# EAGLE schematic debug_backplane (EAGLE 6.6.0)
AUTHOR: Joshua Adkins and Pat Pannuto; REV: A; TITLE: Signpost Debug Backplane

## Sheet 1 of 15
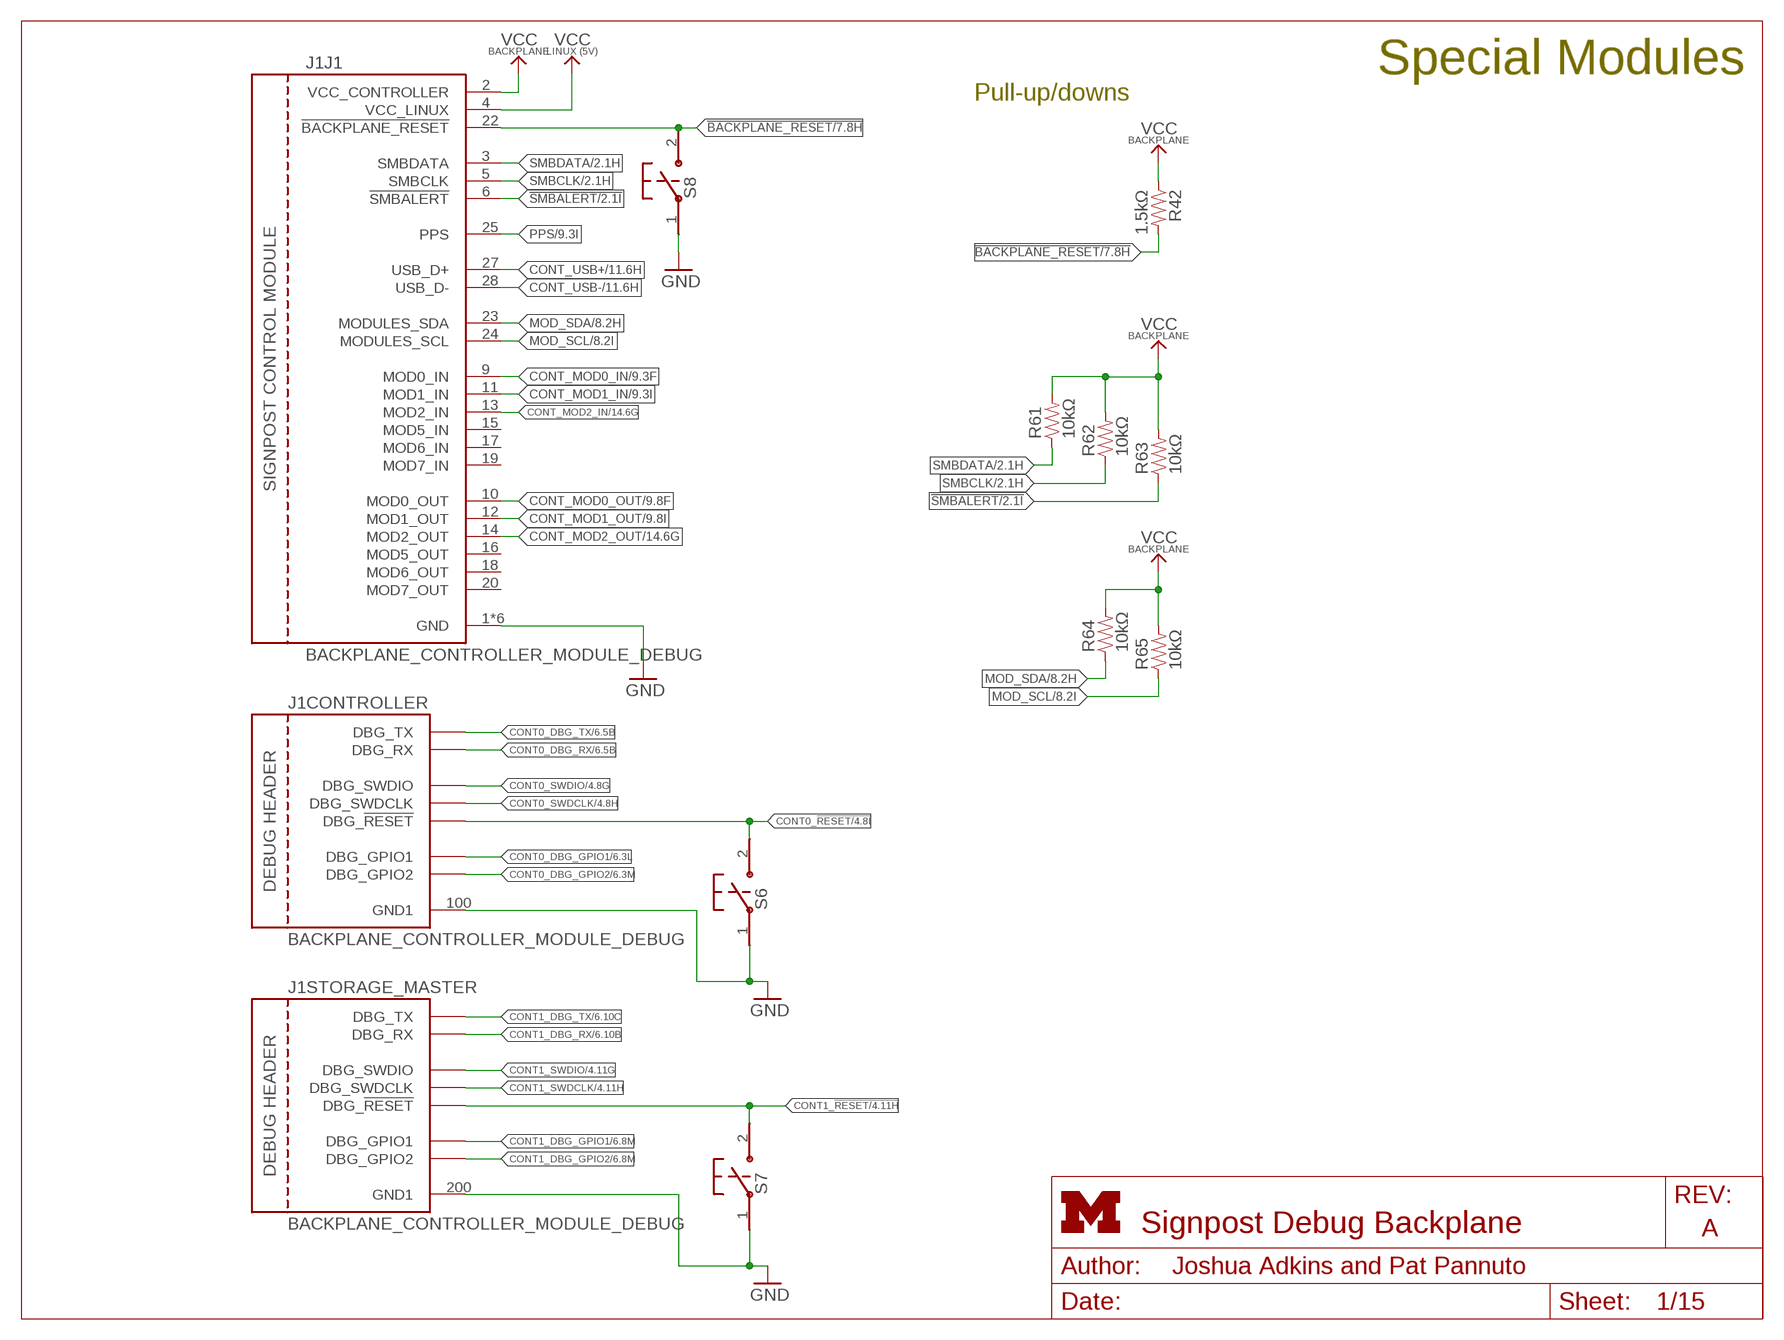
[diagram p0: schematic, sheet 1]
FRAME1 (LETTER_L): HEIGHT: 8.5in; WIDTH: 11in

### Parts
J1  BACKPLANE_CONTROLLER_MODULE_DEBUG  [BACKPLANE_MODULE_20PIN_10PIN_DEBUG]
R42  1.5kΩ  RESISTOR0603_RES  [0603-RES]
R61  10kΩ  RESISTOR0603_RES  [0603-RES]
R62  10kΩ  RESISTOR0603_RES  [0603-RES]
R63  10kΩ  RESISTOR0603_RES  [0603-RES]
R64  10kΩ  RESISTOR0603_RES  [0603-RES]
R65  10kΩ  RESISTOR0603_RES  [0603-RES]
S6  B3U-1000P  [B3U-1000P]
S7  B3U-1000P  [B3U-1000P]
S8  B3U-1000P  [B3U-1000P]

### Nets
!BACKPLANE_RESET: J1.22(J1:!BACKPLANE_RESET) R42.2 S8.2 ; also sheet 7,10,15
!SMBALERT: J1.6(J1:!SMBALERT) R63.1 ; also sheet 2,15
CONT0_!RESET: J1.105(CONTROLLER:DBG_!RESET) S6.2 ; also sheet 4
CONT0_DBG_GPIO1: J1.101(CONTROLLER:DBG_GPIO1) ; also sheet 6
CONT0_DBG_GPIO2: J1.104(CONTROLLER:DBG_GPIO2) ; also sheet 6
CONT0_DBG_RX: J1.103(CONTROLLER:DBG_RX) ; also sheet 6
CONT0_DBG_TX: J1.102(CONTROLLER:DBG_TX) ; also sheet 6
CONT0_SWDCLK: J1.106(CONTROLLER:DBG_SWDCLK) ; also sheet 4
CONT0_SWDIO: J1.107(CONTROLLER:DBG_SWDIO) ; also sheet 4
CONT1_!RESET: J1.205(STORAGE_MASTER:DBG_!RESET) S7.2 ; also sheet 4
CONT1_DBG_GPIO1: J1.201(STORAGE_MASTER:DBG_GPIO1) ; also sheet 6
CONT1_DBG_GPIO2: J1.204(STORAGE_MASTER:DBG_GPIO2) ; also sheet 6
CONT1_DBG_RX: J1.203(STORAGE_MASTER:DBG_RX) ; also sheet 6
CONT1_DBG_TX: J1.202(STORAGE_MASTER:DBG_TX) ; also sheet 6
CONT1_SWDCLK: J1.206(STORAGE_MASTER:DBG_SWDCLK) ; also sheet 4
CONT1_SWDIO: J1.207(STORAGE_MASTER:DBG_SWDIO) ; also sheet 4
CONT_MOD0_IN: J1.9(J1:MOD0_IN) ; also sheet 9
CONT_MOD0_OUT: J1.10(J1:MOD0_OUT) ; also sheet 9
CONT_MOD1_IN: J1.11(J1:MOD1_IN) ; also sheet 9
CONT_MOD1_OUT: J1.12(J1:MOD1_OUT) ; also sheet 9
CONT_MOD2_IN: J1.13(J1:MOD2_IN) ; also sheet 14
CONT_MOD2_OUT: J1.14(J1:MOD2_OUT) ; also sheet 14
CONT_USB+: J1.27(J1:USB_D+) ; also sheet 11
CONT_USB-: J1.28(J1:USB_D-) ; also sheet 11
GND: J1.1(J1:GND) J1.21(J1:GND) J1.100(CONTROLLER:GND1) J1.200(STORAGE_MASTER:GND1) J1.MNT1(J1:GND) J1.MNT2(J1:GND) J1.MNT3(J1:GND) J1.MNT4(J1:GND) S6.1 S7.1 S8.1 ; also sheet 2,3,4,5,6,7,8,9,10,11,12,13,14,15
MOD_SCL: J1.24(J1:MODULES_SCL) R65.1 ; also sheet 8,14,15
MOD_SDA: J1.23(J1:MODULES_SDA) R64.1 ; also sheet 8,14,15
PPS: J1.25(J1:PPS) ; also sheet 9,14,15
SMBCLK: J1.5(J1:SMBCLK) R62.1 ; also sheet 2,7,15
SMBDATA: J1.3(J1:SMBDATA) R61.1 ; also sheet 2,7,15
VCC_BACKPLANE: J1.2(J1:VCC_CONTROLLER) R42.1 R61.2 R62.2 R63.2 R64.2 R65.2 ; also sheet 2,7,8,9,10,11,12,13,15
VCC_LINUX: J1.4(J1:VCC_LINUX) ; also sheet 2,15
Unconnected: J1.15(J1:MOD5_IN) J1.16(J1:MOD5_OUT) J1.17(J1:MOD6_IN) J1.18(J1:MOD6_OUT) J1.19(J1:MOD7_IN) J1.20(J1:MOD7_OUT)

### Notes on the sheet
- Special Modules
- Pull-up/downs

## Sheet 2 of 15
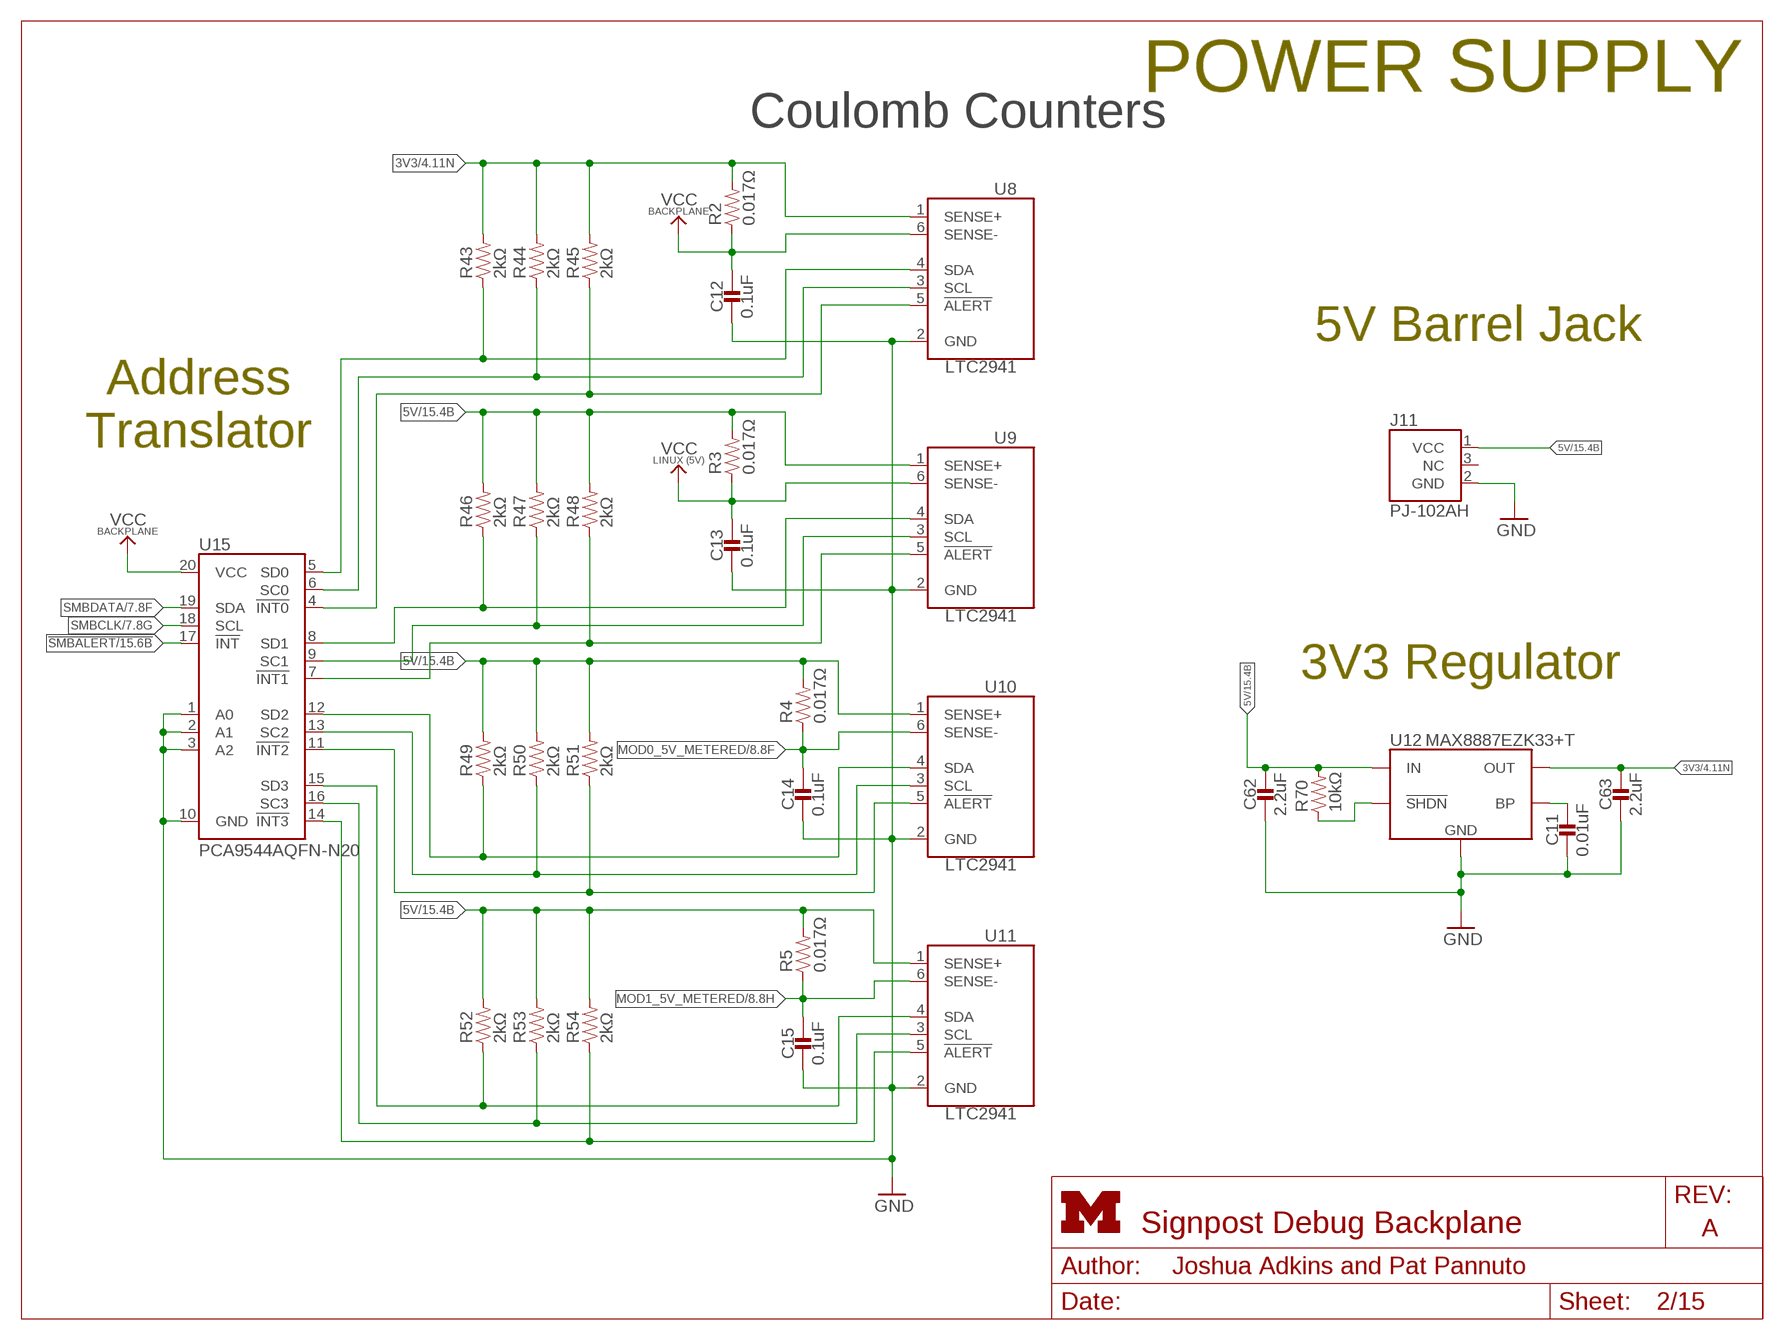
[diagram p1: schematic, sheet 2]
FRAME10 (LETTER_L_UMICH): HEIGHT: 8.5in; WIDTH: 11in

### Parts
C11  0.01uF  CAPACITOR0402_CAP  [0402_CAP]
C12  0.1uF  CAPACITOR0402_CAP  [0402_CAP]
C13  0.1uF  CAPACITOR0402_CAP  [0402_CAP]
C14  0.1uF  CAPACITOR0402_CAP  [0402_CAP]
C15  0.1uF  CAPACITOR0402_CAP  [0402_CAP]
C62  2.2uF  CAPACITOR0603_CAP  [0603_CAP]
C63  2.2uF  CAPACITOR0603_CAP  [0603_CAP]
J11  PJ-102AH  [PJ-102AH]
R2  0.017Ω  RESISTOR0805_RES  [0805_RES]
R3  0.017Ω  RESISTOR0805_RES  [0805_RES]
R4  0.017Ω  RESISTOR0805_RES  [0805_RES]
R5  0.017Ω  RESISTOR0805_RES  [0805_RES]
R43  2kΩ  RESISTOR0402_RES  [0402_RES]
R44  2kΩ  RESISTOR0402_RES  [0402_RES]
R45  2kΩ  RESISTOR0402_RES  [0402_RES]
R46  2kΩ  RESISTOR0402_RES  [0402_RES]
R47  2kΩ  RESISTOR0402_RES  [0402_RES]
R48  2kΩ  RESISTOR0402_RES  [0402_RES]
R49  2kΩ  RESISTOR0402_RES  [0402_RES]
R50  2kΩ  RESISTOR0402_RES  [0402_RES]
R51  2kΩ  RESISTOR0402_RES  [0402_RES]
R52  2kΩ  RESISTOR0402_RES  [0402_RES]
R53  2kΩ  RESISTOR0402_RES  [0402_RES]
R54  2kΩ  RESISTOR0402_RES  [0402_RES]
R70  10kΩ  RESISTOR0603_RES  [0603-RES]
U8  LTC2941  [DFN-6-2MMX3MM]
U9  LTC2941  [DFN-6-2MMX3MM]
U10  LTC2941  [DFN-6-2MMX3MM]
U11  LTC2941  [DFN-6-2MMX3MM]
U12  MAX8887EZK33+T  [SOT-23-5]
U15  PCA9544AQFN-N20  [QFN-N20]

### Nets
3V3: C63.1 R2.2 R43.2 R44.2 R45.2 U8.1(SENSE+) U12.5(OUT) ; also sheet 4,5,6,14,15
5V: C62.1 J11.1(VCC) R3.2 R4.2 R5.2 R46.2 R47.2 R48.2 R49.2 R50.2 R51.2 R52.2 R53.2 R54.2 R70.2 U9.1(SENSE+) U10.1(SENSE+) U11.1(SENSE+) U12.1(IN) ; also sheet 15
!SMBALERT: U15.17(!INT) ; also sheet 1,15
GND: C11.2 C12.2 C13.2 C14.2 C15.2 C62.2 C63.2 J11.2(GND) U8.2(GND) U9.2(GND) U10.2(GND) U11.2(GND) U12.2(GND) U15.1(A0) U15.2(A1) U15.3(A2) U15.10(GND) ; also sheet 1,3,4,5,6,7,8,9,10,11,12,13,14,15
MOD0_5V_METERED: C14.1 R4.1 U10.6(SENSE-) ; also sheet 8,13,15
MOD1_5V_METERED: C15.1 R5.1 U11.6(SENSE-) ; also sheet 8,13,15
N$4: R70.1 U12.3(!SHDN)
N$7: C11.1 U12.4(BP)
N$43: R43.1 U8.4(SDA) U15.5(SD0)
N$47: R44.1 U8.3(SCL) U15.6(SC0)
N$52: R49.1 U10.4(SDA) U15.12(SD2)
N$53: R50.1 U10.3(SCL) U15.13(SC2)
N$54: R51.1 U10.5(!ALERT) U15.11(!INT2)
N$55: R52.1 U11.4(SDA) U15.15(SD3)
N$56: R53.1 U11.3(SCL) U15.16(SC3)
N$57: R54.1 U11.5(!ALERT) U15.14(!INT3)
N$67: R45.1 U8.5(!ALERT) U15.4(!INT0)
N$68: R46.1 U9.4(SDA) U15.8(SD1)
N$70: R47.1 U9.3(SCL) U15.9(SC1)
N$71: R48.1 U9.5(!ALERT) U15.7(!INT1)
SMBCLK: U15.18(SCL) ; also sheet 1,7,15
SMBDATA: U15.19(SDA) ; also sheet 1,7,15
VCC_BACKPLANE: C12.1 R2.1 U8.6(SENSE-) U15.20(VCC) ; also sheet 1,7,8,9,10,11,12,13,15
VCC_LINUX: C13.1 R3.1 U9.6(SENSE-) ; also sheet 1,15
Unconnected: J11.3(NC)

### Notes on the sheet
- POWER SUPPLY
- Coulomb Counters
- 5V Barrel Jack
- Address
  Translator
- 3V3 Regulator

## Sheet 3 of 15
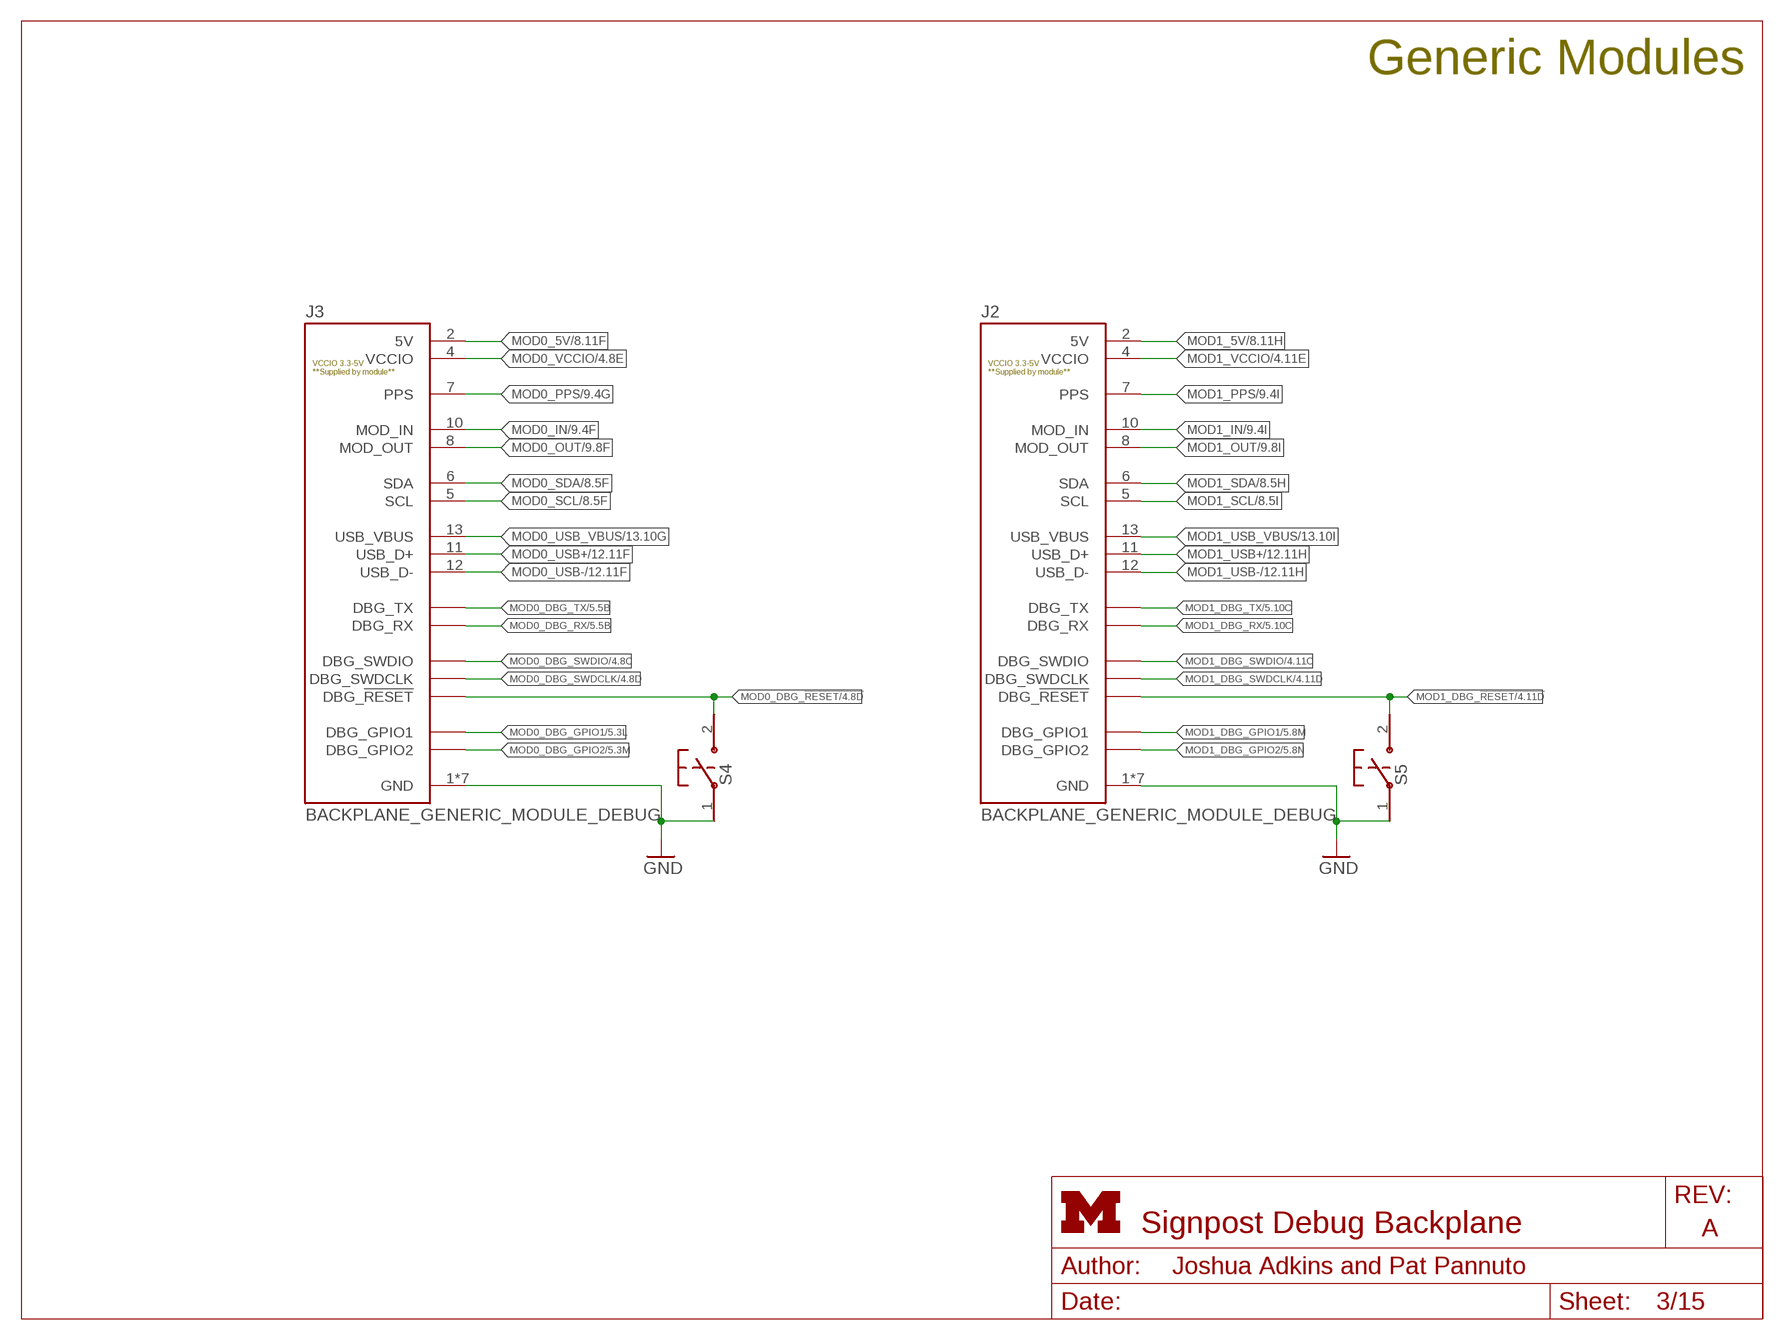
[diagram p2: schematic, sheet 3]
FRAME2 (LETTER_L): HEIGHT: 8.5in; WIDTH: 11in

### Parts
J2  BACKPLANE_GENERIC_MODULE_DEBUG  [BACKPLANE_MODULE_14PIN_8PIN]
J3  BACKPLANE_GENERIC_MODULE_DEBUG  [BACKPLANE_MODULE_14PIN_8PIN]
S4  B3U-1000P  [B3U-1000P]
S5  B3U-1000P  [B3U-1000P]

### Nets
GND: J2.1(GND) J2.14(GND) J2.15(GND) J2.MNT1(GND) J2.MNT2(GND) J2.MNT3(GND) J2.MNT4(GND) J3.1(GND) J3.14(GND) J3.15(GND) J3.MNT1(GND) J3.MNT2(GND) J3.MNT3(GND) J3.MNT4(GND) S4.1 S5.1 ; also sheet 1,2,4,5,6,7,8,9,10,11,12,13,14,15
MOD0_5V: J3.2(5V) ; also sheet 8,15
MOD0_DBG_!RESET: J3.20(DBG_!RESET) S4.2 ; also sheet 4
MOD0_DBG_GPIO1: J3.16(DBG_GPIO1) ; also sheet 5
MOD0_DBG_GPIO2: J3.19(DBG_GPIO2) ; also sheet 5
MOD0_DBG_RX: J3.18(DBG_RX) ; also sheet 5
MOD0_DBG_SWDCLK: J3.21(DBG_SWDCLK) ; also sheet 4
MOD0_DBG_SWDIO: J3.22(DBG_SWDIO) ; also sheet 4
MOD0_DBG_TX: J3.17(DBG_TX) ; also sheet 5
MOD0_IN: J3.10(MOD_IN) ; also sheet 9,15
MOD0_OUT: J3.8(MOD_OUT) ; also sheet 9,15
MOD0_PPS: J3.7(PPS) ; also sheet 9,15
MOD0_SCL: J3.5(SCL) ; also sheet 8,15
MOD0_SDA: J3.6(SDA) ; also sheet 8,15
MOD0_USB+: J3.11(USB_D+) ; also sheet 12
MOD0_USB-: J3.12(USB_D-) ; also sheet 12
MOD0_USB_VBUS: J3.13(USB_VBUS) ; also sheet 13,15
MOD0_VCCIO: J3.4(VCCIO) ; also sheet 4,5,8,9,15
MOD1_5V: J2.2(5V) ; also sheet 8,15
MOD1_DBG_!RESET: J2.20(DBG_!RESET) S5.2 ; also sheet 4
MOD1_DBG_GPIO1: J2.16(DBG_GPIO1) ; also sheet 5
MOD1_DBG_GPIO2: J2.19(DBG_GPIO2) ; also sheet 5
MOD1_DBG_RX: J2.18(DBG_RX) ; also sheet 5
MOD1_DBG_SWDCLK: J2.21(DBG_SWDCLK) ; also sheet 4
MOD1_DBG_SWDIO: J2.22(DBG_SWDIO) ; also sheet 4
MOD1_DBG_TX: J2.17(DBG_TX) ; also sheet 5
MOD1_IN: J2.10(MOD_IN) ; also sheet 9,15
MOD1_OUT: J2.8(MOD_OUT) ; also sheet 9,15
MOD1_PPS: J2.7(PPS) ; also sheet 9,15
MOD1_SCL: J2.5(SCL) ; also sheet 8,15
MOD1_SDA: J2.6(SDA) ; also sheet 8,15
MOD1_USB+: J2.11(USB_D+) ; also sheet 12
MOD1_USB-: J2.12(USB_D-) ; also sheet 12
MOD1_USB_VBUS: J2.13(USB_VBUS) ; also sheet 13,15
MOD1_VCCIO: J2.4(VCCIO) ; also sheet 4,5,8,9,15

### Notes on the sheet
- Generic Modules

## Sheet 4 of 15
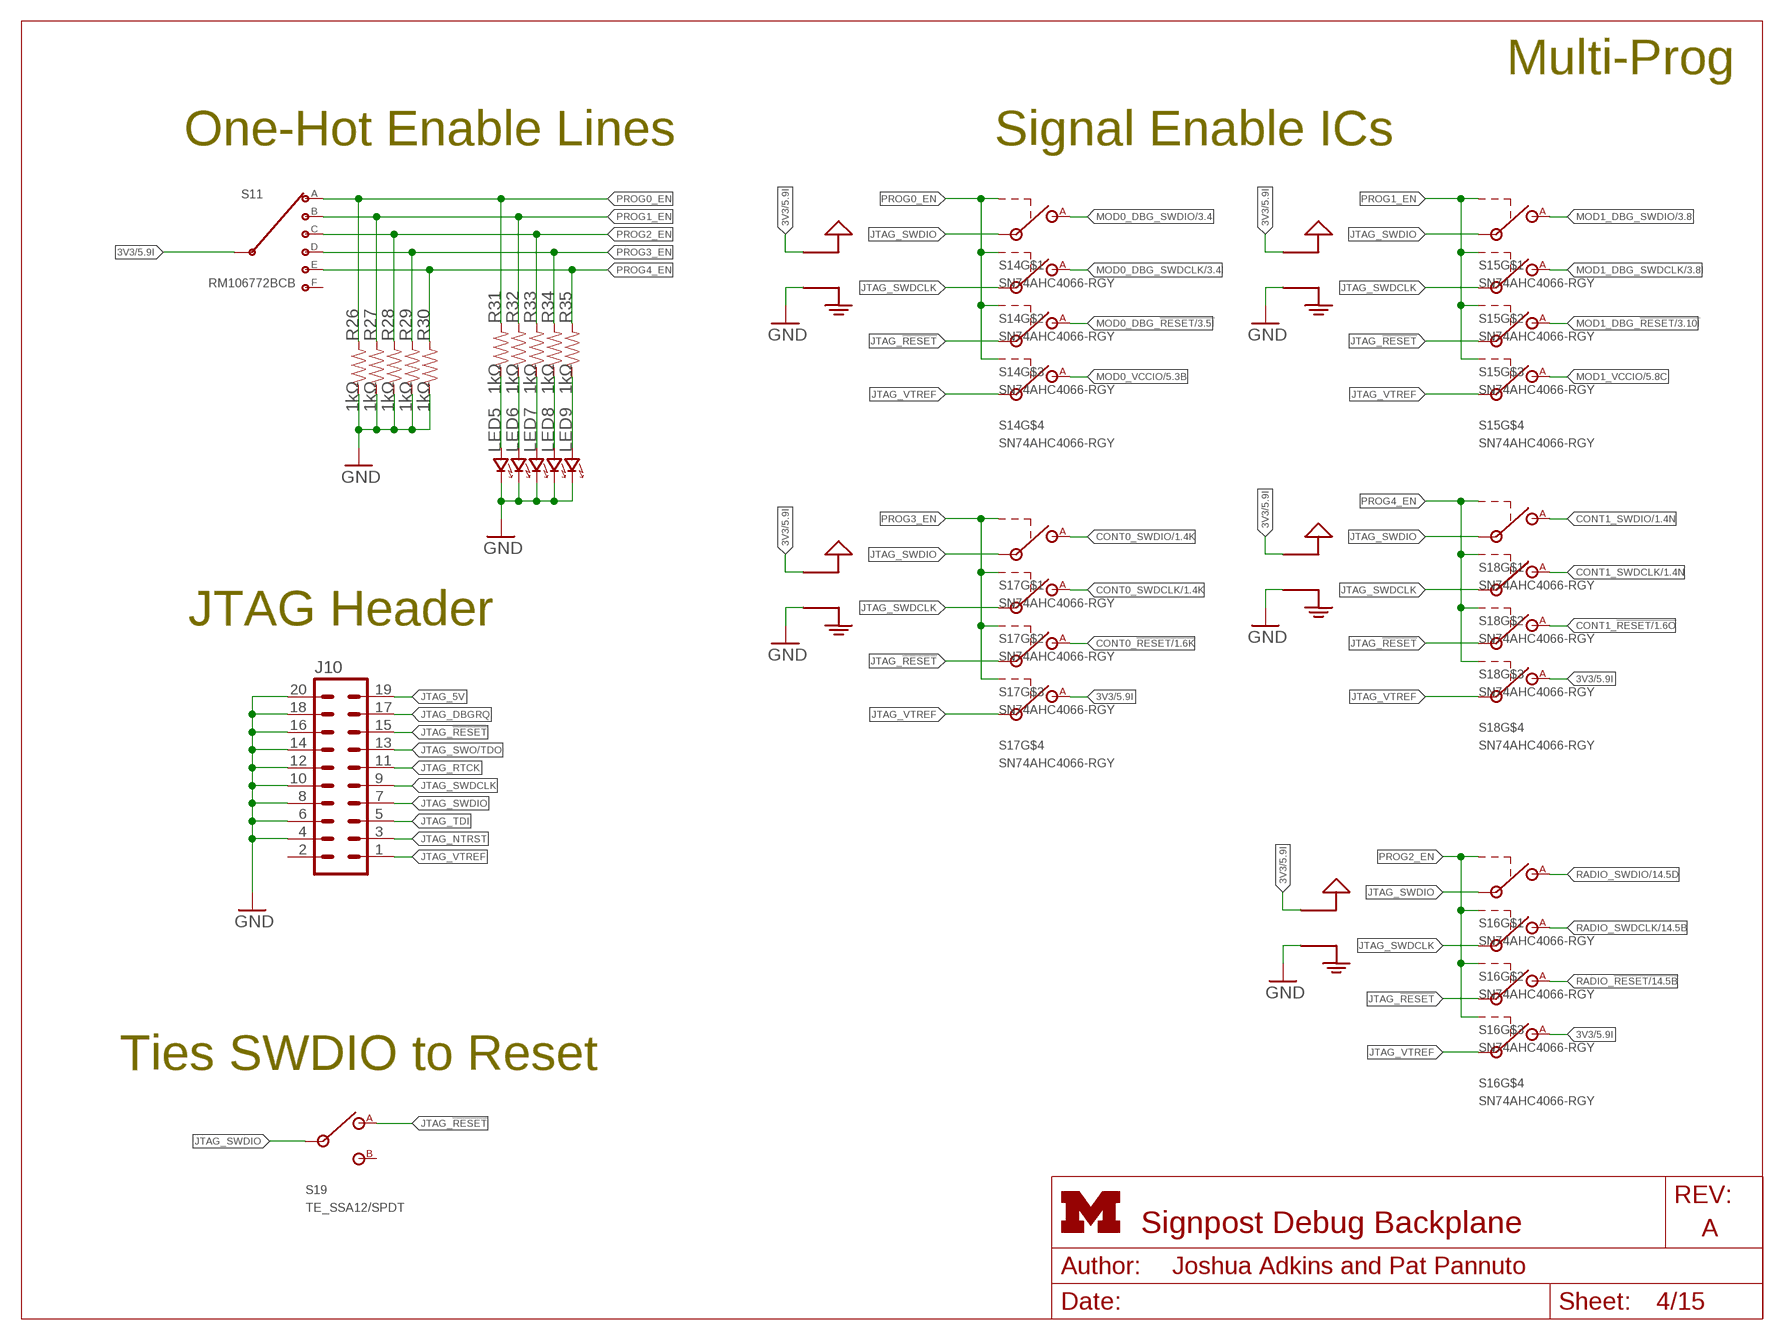
[diagram p3: schematic, sheet 4]
FRAME15 (LETTER_L_UMICH): HEIGHT: 8.5in; WIDTH: 11in

### Parts
J10  ML20  [ML20]
LED5  LED0603  [LED-0603]
LED6  LED0603  [LED-0603]
LED7  LED0603  [LED-0603]
LED8  LED0603  [LED-0603]
LED9  LED0603  [LED-0603]
R26  1kΩ  RESISTOR0603_RES  [0603-RES]
R27  1kΩ  RESISTOR0603_RES  [0603-RES]
R28  1kΩ  RESISTOR0603_RES  [0603-RES]
R29  1kΩ  RESISTOR0603_RES  [0603-RES]
R30  1kΩ  RESISTOR0603_RES  [0603-RES]
R31  1kΩ  RESISTOR0603_RES  [0603-RES]
R32  1kΩ  RESISTOR0603_RES  [0603-RES]
R33  1kΩ  RESISTOR0603_RES  [0603-RES]
R34  1kΩ  RESISTOR0603_RES  [0603-RES]
R35  1kΩ  RESISTOR0603_RES  [0603-RES]
S11  RM106772BCB  [RM-SWITCH]
S14  SN74AHC4066-RGY  [S-PVQFN-N14-3.5MM]
S15  SN74AHC4066-RGY  [S-PVQFN-N14-3.5MM]
S16  SN74AHC4066-RGY  [S-PVQFN-N14-3.5MM]
S17  SN74AHC4066-RGY  [S-PVQFN-N14-3.5MM]
S18  SN74AHC4066-RGY  [S-PVQFN-N14-3.5MM]
S19  TE_SSA12/SPDT  [TE_SSA12/SPDT]

### Nets
3V3: S11.C(INPUT) S14.14(VCC) S15.14(VCC) S16.10(A) S16.14(VCC) S17.10(A) S17.14(VCC) S18.10(A) S18.14(VCC) ; also sheet 2,5,6,14,15
CONT0_!RESET: S17.9(A) ; also sheet 1
CONT0_SWDCLK: S17.3(A) ; also sheet 1
CONT0_SWDIO: S17.2(A) ; also sheet 1
CONT1_!RESET: S18.9(A) ; also sheet 1
CONT1_SWDCLK: S18.3(A) ; also sheet 1
CONT1_SWDIO: S18.2(A) ; also sheet 1
GND: J10.4 J10.6 J10.8 J10.10 J10.12 J10.14 J10.16 J10.18 J10.20 LED5.C(CATHODE) LED6.C(CATHODE) LED7.C(CATHODE) LED8.C(CATHODE) LED9.C(CATHODE) R26.1 R27.1 R28.1 R29.1 R30.1 S14.7(GND) S15.7(GND) S16.7(GND) S17.7(GND) S18.7(GND) ; also sheet 1,2,3,5,6,7,8,9,10,11,12,13,14,15
JTAG_5V: J10.19
JTAG_!RESET: J10.15 S14.8(IN) S15.8(IN) S16.8(IN) S17.8(IN) S18.8(IN) S19.1(A)
JTAG_DBGRQ: J10.17
JTAG_NTRST: J10.3
JTAG_RTCK: J10.11
JTAG_SWDCLK: J10.9 S14.4(IN) S15.4(IN) S16.4(IN) S17.4(IN) S18.4(IN)
JTAG_SWDIO: J10.7 S14.1(IN) S15.1(IN) S16.1(IN) S17.1(IN) S18.1(IN) S19.IN
JTAG_SWO/TDO: J10.13
JTAG_TDI: J10.5
JTAG_VTREF: J10.1 S14.11(IN) S15.11(IN) S16.11(IN) S17.11(IN) S18.11(IN)
MOD0_DBG_!RESET: S14.9(A) ; also sheet 3
MOD0_DBG_SWDCLK: S14.3(A) ; also sheet 3
MOD0_DBG_SWDIO: S14.2(A) ; also sheet 3
MOD0_VCCIO: S14.10(A) ; also sheet 3,5,8,9,15
MOD1_DBG_!RESET: S15.9(A) ; also sheet 3
MOD1_DBG_SWDCLK: S15.3(A) ; also sheet 3
MOD1_DBG_SWDIO: S15.2(A) ; also sheet 3
MOD1_VCCIO: S15.10(A) ; also sheet 3,5,8,9,15
N$28: LED6.A(ANODE) R32.1
N$58: LED5.A(ANODE) R31.1
N$59: LED7.A(ANODE) R33.1
N$60: LED8.A(ANODE) R34.1
N$61: LED9.A(ANODE) R35.1
PROG0_EN: R26.2 R31.2 S11.1(A) S14.5(CTRL) S14.6(CTRL) S14.12(CTRL) S14.13(CTRL)
PROG1_EN: R27.2 R32.2 S11.2(B) S15.5(CTRL) S15.6(CTRL) S15.12(CTRL) S15.13(CTRL)
PROG2_EN: R28.2 R33.2 S11.3(C) S16.5(CTRL) S16.6(CTRL) S16.12(CTRL) S16.13(CTRL)
PROG3_EN: R29.2 R34.2 S11.4(D) S17.5(CTRL) S17.6(CTRL) S17.12(CTRL) S17.13(CTRL)
PROG4_EN: R30.2 R35.2 S11.5(E) S18.5(CTRL) S18.6(CTRL) S18.12(CTRL) S18.13(CTRL)
RADIO_!RESET: S16.9(A) ; also sheet 14
RADIO_SWDCLK: S16.3(A) ; also sheet 14
RADIO_SWDIO: S16.2(A) ; also sheet 14
Unconnected: J10.2 S11.6(F) S19.2(B)

### Notes on the sheet
- Multi-Prog
- One-Hot Enable Lines | Signal Enable ICs
- JTAG Header
- Ties SWDIO to Reset

## Sheet 5 of 15
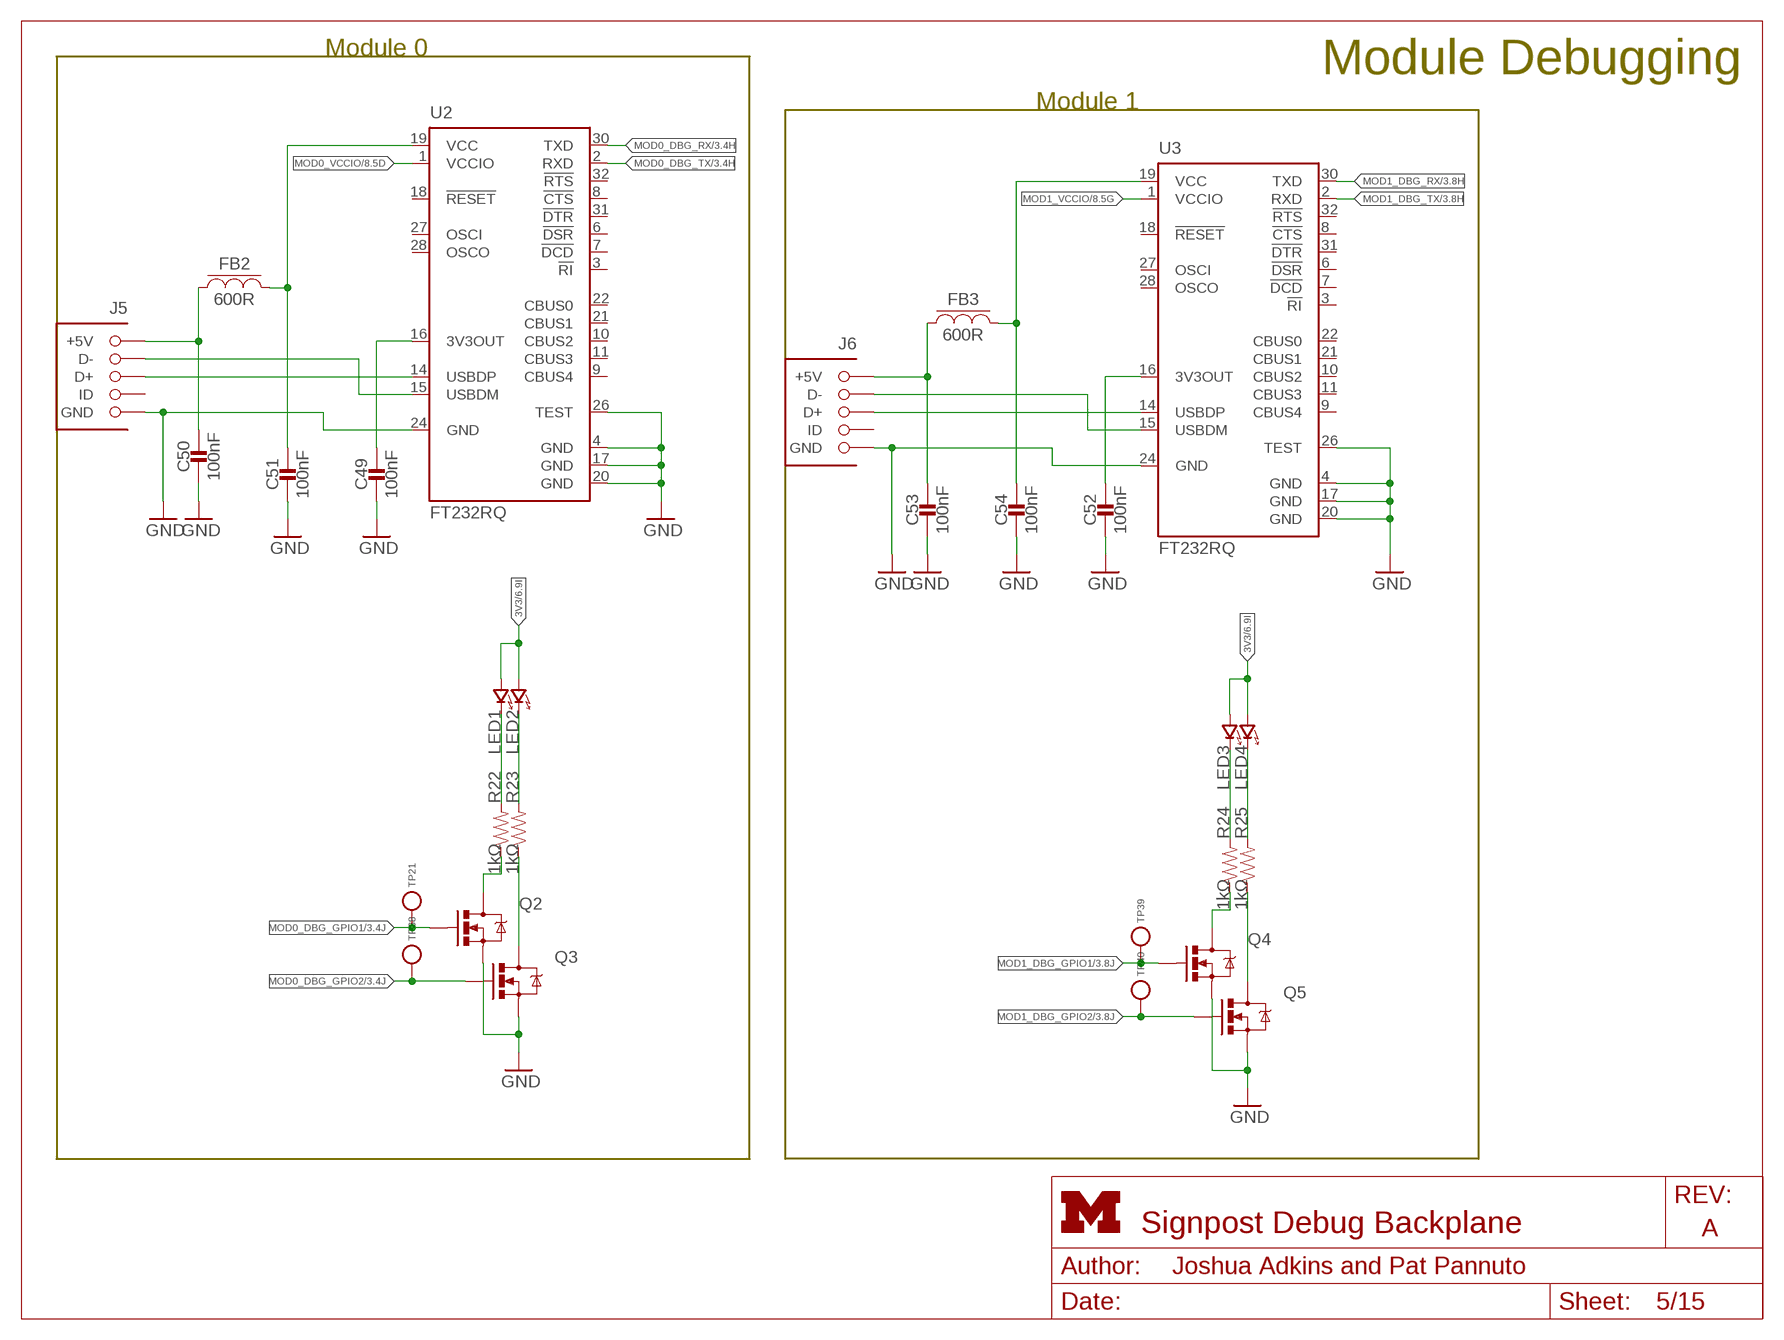
[diagram p4: schematic, sheet 5]
FRAME12 (LETTER_L_UMICH): HEIGHT: 8.5in; WIDTH: 11in

### Parts
C49  100nF  CAPACITOR0603_CAP  [0603_CAP]
C50  100nF  CAPACITOR0603_CAP  [0603_CAP]
C51  100nF  CAPACITOR0603_CAP  [0603_CAP]
C52  100nF  CAPACITOR0603_CAP  [0603_CAP]
C53  100nF  CAPACITOR0603_CAP  [0603_CAP]
C54  100nF  CAPACITOR0603_CAP  [0603_CAP]
FB2  600R  FERRITE_BEAD0603  [0603_CAP]
FB3  600R  FERRITE_BEAD0603  [0603_CAP]
J5  MICRO_USB_B_HIROSE_ZX62R-B-5P  [USB_MICRO_B-HIROSE-ZX62R-B-5P]
J6  MICRO_USB_B_HIROSE_ZX62R-B-5P  [USB_MICRO_B-HIROSE-ZX62R-B-5P]
LED1  LED0603  [LED-0603]
LED2  LED0603  [LED-0603]
LED3  LED0603  [LED-0603]
LED4  LED0603  [LED-0603]
Q2  MOSFET-NCHANNELSMD  [SOT23-3]
Q3  MOSFET-NCHANNELSMD  [SOT23-3]
Q4  MOSFET-NCHANNELSMD  [SOT23-3]
Q5  MOSFET-NCHANNELSMD  [SOT23-3]
R22  1kΩ  RESISTOR0603_RES  [0603-RES]
R23  1kΩ  RESISTOR0603_RES  [0603-RES]
R24  1kΩ  RESISTOR0603_RES  [0603-RES]
R25  1kΩ  RESISTOR0603_RES  [0603-RES]
TP21  TEST_POINT_0.040IN  [TESTPOINT_0.040IN]
TP38  TEST_POINT_0.040IN  [TESTPOINT_0.040IN]
TP39  TEST_POINT_0.040IN  [TESTPOINT_0.040IN]
TP40  TEST_POINT_0.040IN  [TESTPOINT_0.040IN]
U2  FT232RQ  [QFN32]
U3  FT232RQ  [QFN32]

### Nets
3V3: LED1.A(ANODE) LED2.A(ANODE) LED3.A(ANODE) LED4.A(ANODE) ; also sheet 2,4,6,14,15
GND: C49.2 C50.2 C51.2 C52.2 C53.2 C54.2 J5.5(GND) J6.5(GND) Q2.2(S) Q3.2(S) Q4.2(S) Q5.2(S) U2.4(GND) U2.17(GND) U2.20(GND) U2.24(GND) U2.26(TEST) U3.4(GND) U3.17(GND) U3.20(GND) U3.24(GND) U3.26(TEST) ; also sheet 1,2,3,4,6,7,8,9,10,11,12,13,14,15
MOD0_DBG_GPIO1: Q2.1(G) TP21.TESTPOINT ; also sheet 3
MOD0_DBG_GPIO2: Q3.1(G) TP38.TESTPOINT ; also sheet 3
MOD0_DBG_RX: U2.30(TXD) ; also sheet 3
MOD0_DBG_TX: U2.2(RXD) ; also sheet 3
MOD0_VCCIO: U2.1(VCCIO) ; also sheet 3,4,8,9,15
MOD1_DBG_GPIO1: Q4.1(G) TP39.TESTPOINT ; also sheet 3
MOD1_DBG_GPIO2: Q5.1(G) TP40.TESTPOINT ; also sheet 3
MOD1_DBG_RX: U3.30(TXD) ; also sheet 3
MOD1_DBG_TX: U3.2(RXD) ; also sheet 3
MOD1_VCCIO: U3.1(VCCIO) ; also sheet 3,4,8,9,15
N$5: LED1.C(CATHODE) R22.2
N$6: LED2.C(CATHODE) R23.2
N$8: Q2.3(D) R22.1
N$9: Q3.3(D) R23.1
N$15: LED3.C(CATHODE) R24.2
N$16: LED4.C(CATHODE) R25.2
N$18: Q4.3(D) R24.1
N$19: Q5.3(D) R25.1
N$24: J5.2(D-) U2.15(USBDM)
N$29: J5.3(D+) U2.14(USBDP)
N$30: C50.1 FB2.1 J5.1(+5V)
N$32: C51.1 FB2.2 U2.19(VCC)
N$34: C49.1 U2.16(3V3OUT)
N$35: J6.2(D-) U3.15(USBDM)
N$36: J6.3(D+) U3.14(USBDP)
N$37: C53.1 FB3.1 J6.1(+5V)
N$50: C54.1 FB3.2 U3.19(VCC)
N$51: C52.1 U3.16(3V3OUT)
Unconnected: J5.4(ID) J6.4(ID) U2.3(!RI) U2.6(!DSR) U2.7(!DCD) U2.8(!CTS) U2.9(CBUS4) U2.10(CBUS2) U2.11(CBUS3) U2.18(!RESET) U2.21(CBUS1) U2.22(CBUS0) U2.27(OSCI) U2.28(OSCO) U2.31(!DTR) U2.32(!RTS) U3.3(!RI) U3.6(!DSR) U3.7(!DCD) U3.8(!CTS) U3.9(CBUS4) U3.10(CBUS2) U3.11(CBUS3) U3.18(!RESET) U3.21(CBUS1) U3.22(CBUS0) U3.27(OSCI) U3.28(OSCO) U3.31(!DTR) U3.32(!RTS)

### Notes on the sheet
- Module 0
- Module Debugging
- Module 1

## Sheet 6 of 15
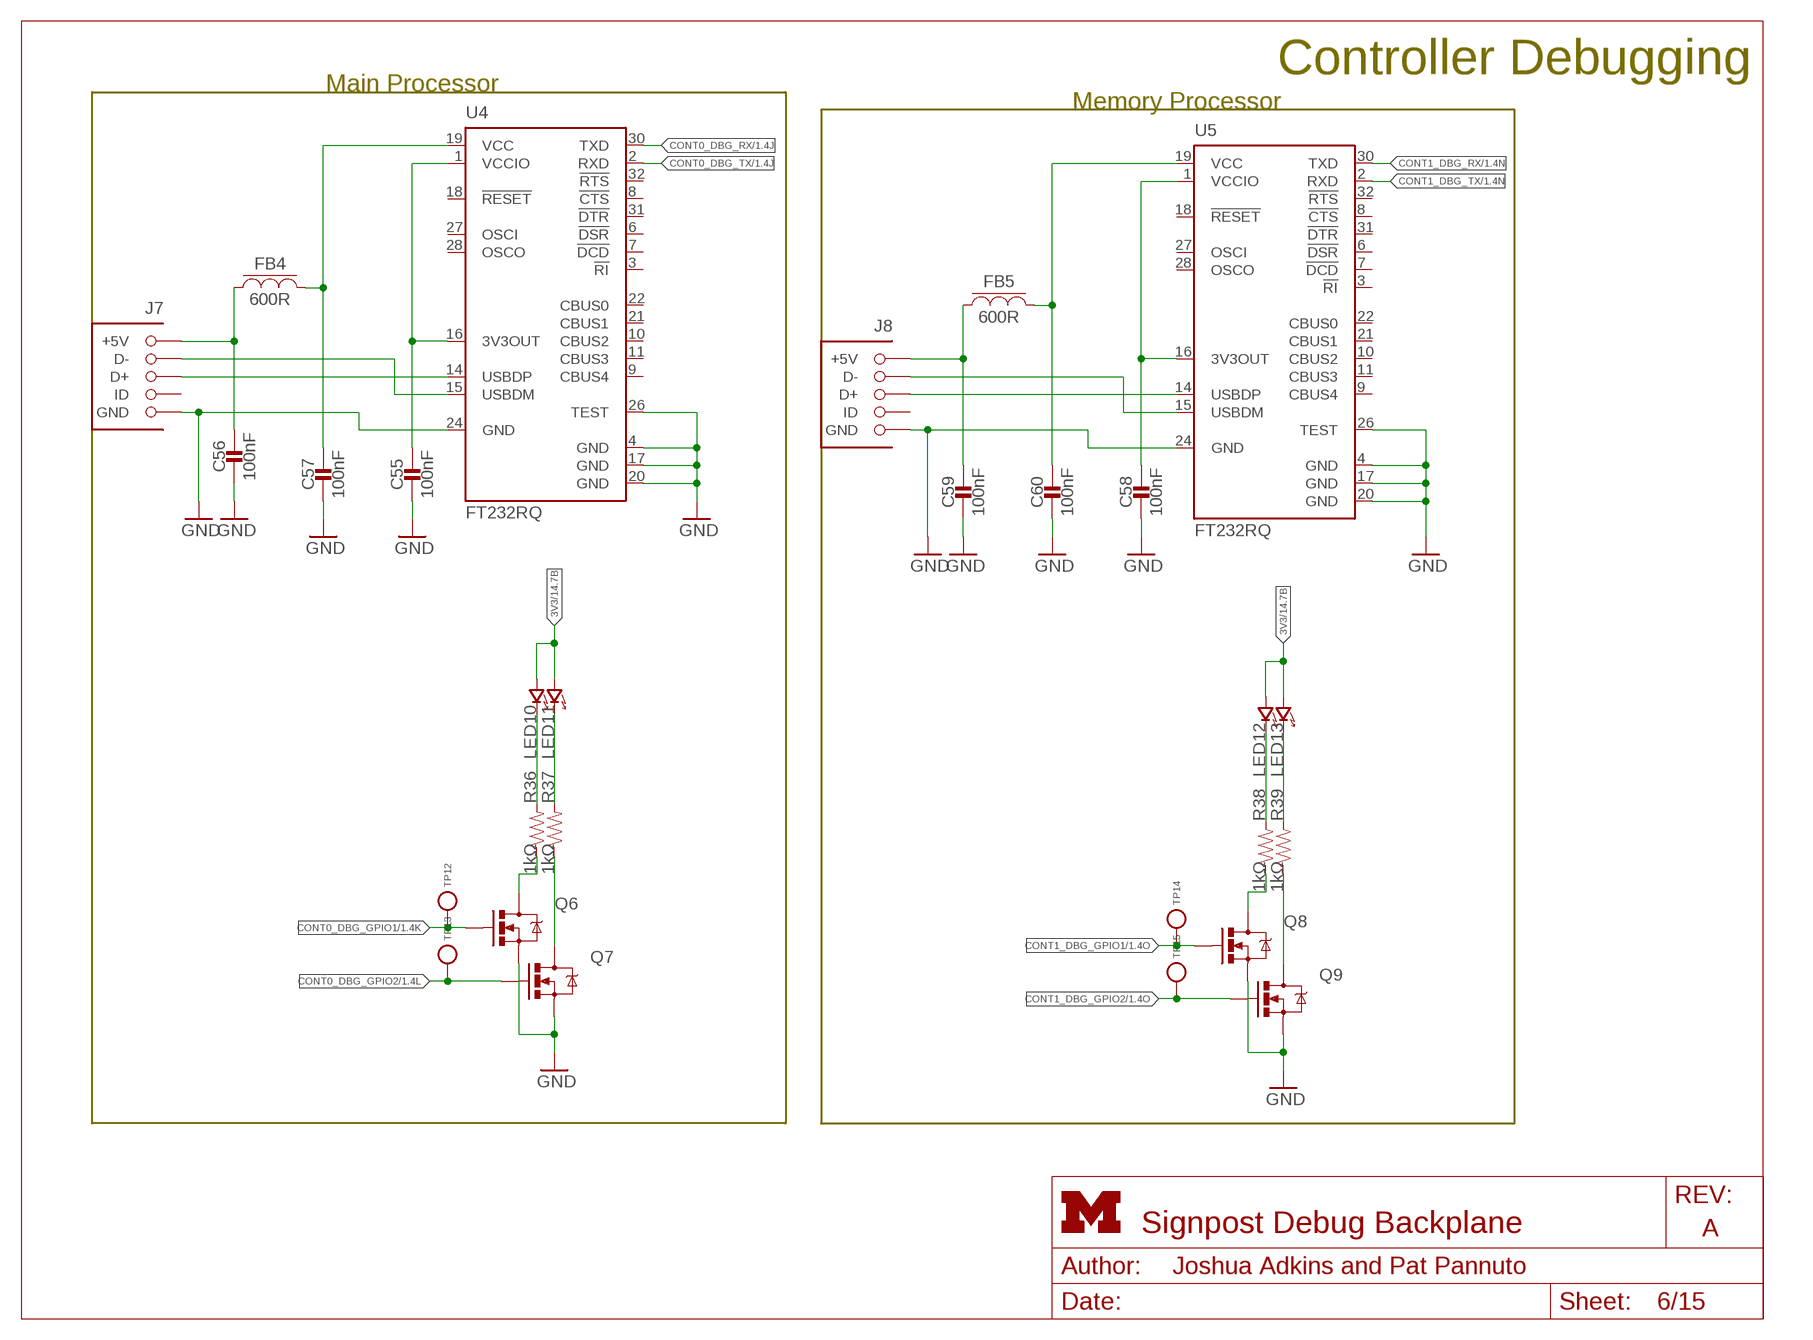
[diagram p5: schematic, sheet 6]
FRAME13 (LETTER_L_UMICH): HEIGHT: 8.5in; WIDTH: 11in

### Parts
C55  100nF  CAPACITOR0603_CAP  [0603_CAP]
C56  100nF  CAPACITOR0603_CAP  [0603_CAP]
C57  100nF  CAPACITOR0603_CAP  [0603_CAP]
C58  100nF  CAPACITOR0603_CAP  [0603_CAP]
C59  100nF  CAPACITOR0603_CAP  [0603_CAP]
C60  100nF  CAPACITOR0603_CAP  [0603_CAP]
FB4  600R  FERRITE_BEAD0603  [0603_CAP]
FB5  600R  FERRITE_BEAD0603  [0603_CAP]
J7  MICRO_USB_B_HIROSE_ZX62R-B-5P  [USB_MICRO_B-HIROSE-ZX62R-B-5P]
J8  MICRO_USB_B_HIROSE_ZX62R-B-5P  [USB_MICRO_B-HIROSE-ZX62R-B-5P]
LED10  LED0603  [LED-0603]
LED11  LED0603  [LED-0603]
LED12  LED0603  [LED-0603]
LED13  LED0603  [LED-0603]
Q6  MOSFET-NCHANNELSMD  [SOT23-3]
Q7  MOSFET-NCHANNELSMD  [SOT23-3]
Q8  MOSFET-NCHANNELSMD  [SOT23-3]
Q9  MOSFET-NCHANNELSMD  [SOT23-3]
R36  1kΩ  RESISTOR0603_RES  [0603-RES]
R37  1kΩ  RESISTOR0603_RES  [0603-RES]
R38  1kΩ  RESISTOR0603_RES  [0603-RES]
R39  1kΩ  RESISTOR0603_RES  [0603-RES]
TP12  TEST_POINT_0.040IN  [TESTPOINT_0.040IN]
TP13  TEST_POINT_0.040IN  [TESTPOINT_0.040IN]
TP14  TEST_POINT_0.040IN  [TESTPOINT_0.040IN]
TP15  TEST_POINT_0.040IN  [TESTPOINT_0.040IN]
U4  FT232RQ  [QFN32]
U5  FT232RQ  [QFN32]

### Nets
3V3: LED10.A(ANODE) LED11.A(ANODE) LED12.A(ANODE) LED13.A(ANODE) ; also sheet 2,4,5,14,15
CONT0_DBG_GPIO1: Q6.1(G) TP12.TESTPOINT ; also sheet 1
CONT0_DBG_GPIO2: Q7.1(G) TP13.TESTPOINT ; also sheet 1
CONT0_DBG_RX: U4.30(TXD) ; also sheet 1
CONT0_DBG_TX: U4.2(RXD) ; also sheet 1
CONT0_VCCIO: C55.1 U4.1(VCCIO) U4.16(3V3OUT)
CONT1_DBG_GPIO1: Q8.1(G) TP14.TESTPOINT ; also sheet 1
CONT1_DBG_GPIO2: Q9.1(G) TP15.TESTPOINT ; also sheet 1
CONT1_DBG_RX: U5.30(TXD) ; also sheet 1
CONT1_DBG_TX: U5.2(RXD) ; also sheet 1
CONT1_VCCIO: C58.1 U5.1(VCCIO) U5.16(3V3OUT)
GND: C55.2 C56.2 C57.2 C58.2 C59.2 C60.2 J7.5(GND) J8.5(GND) Q6.2(S) Q7.2(S) Q8.2(S) Q9.2(S) U4.4(GND) U4.17(GND) U4.20(GND) U4.24(GND) U4.26(TEST) U5.4(GND) U5.17(GND) U5.20(GND) U5.24(GND) U5.26(TEST) ; also sheet 1,2,3,4,5,7,8,9,10,11,12,13,14,15
N$20: J7.2(D-) U4.15(USBDM)
N$21: J7.3(D+) U4.14(USBDP)
N$22: C56.1 FB4.1 J7.1(+5V)
N$23: C57.1 FB4.2 U4.19(VCC)
N$62: J8.2(D-) U5.15(USBDM)
N$63: J8.3(D+) U5.14(USBDP)
N$64: C59.1 FB5.1 J8.1(+5V)
N$65: C60.1 FB5.2 U5.19(VCC)
N$69: LED10.C(CATHODE) R36.2
N$72: LED11.C(CATHODE) R37.2
N$75: Q6.3(D) R36.1
N$76: Q7.3(D) R37.1
N$77: LED12.C(CATHODE) R38.2
N$78: LED13.C(CATHODE) R39.2
N$79: Q8.3(D) R38.1
N$80: Q9.3(D) R39.1
Unconnected: J7.4(ID) J8.4(ID) U4.3(!RI) U4.6(!DSR) U4.7(!DCD) U4.8(!CTS) U4.9(CBUS4) U4.10(CBUS2) U4.11(CBUS3) U4.18(!RESET) U4.21(CBUS1) U4.22(CBUS0) U4.27(OSCI) U4.28(OSCO) U4.31(!DTR) U4.32(!RTS) U5.3(!RI) U5.6(!DSR) U5.7(!DCD) U5.8(!CTS) U5.9(CBUS4) U5.10(CBUS2) U5.11(CBUS3) U5.18(!RESET) U5.21(CBUS1) U5.22(CBUS0) U5.27(OSCI) U5.28(OSCO) U5.31(!DTR) U5.32(!RTS)

### Notes on the sheet
- Controller Debugging
- Main Processor
- Memory Processor

## Sheet 7 of 15
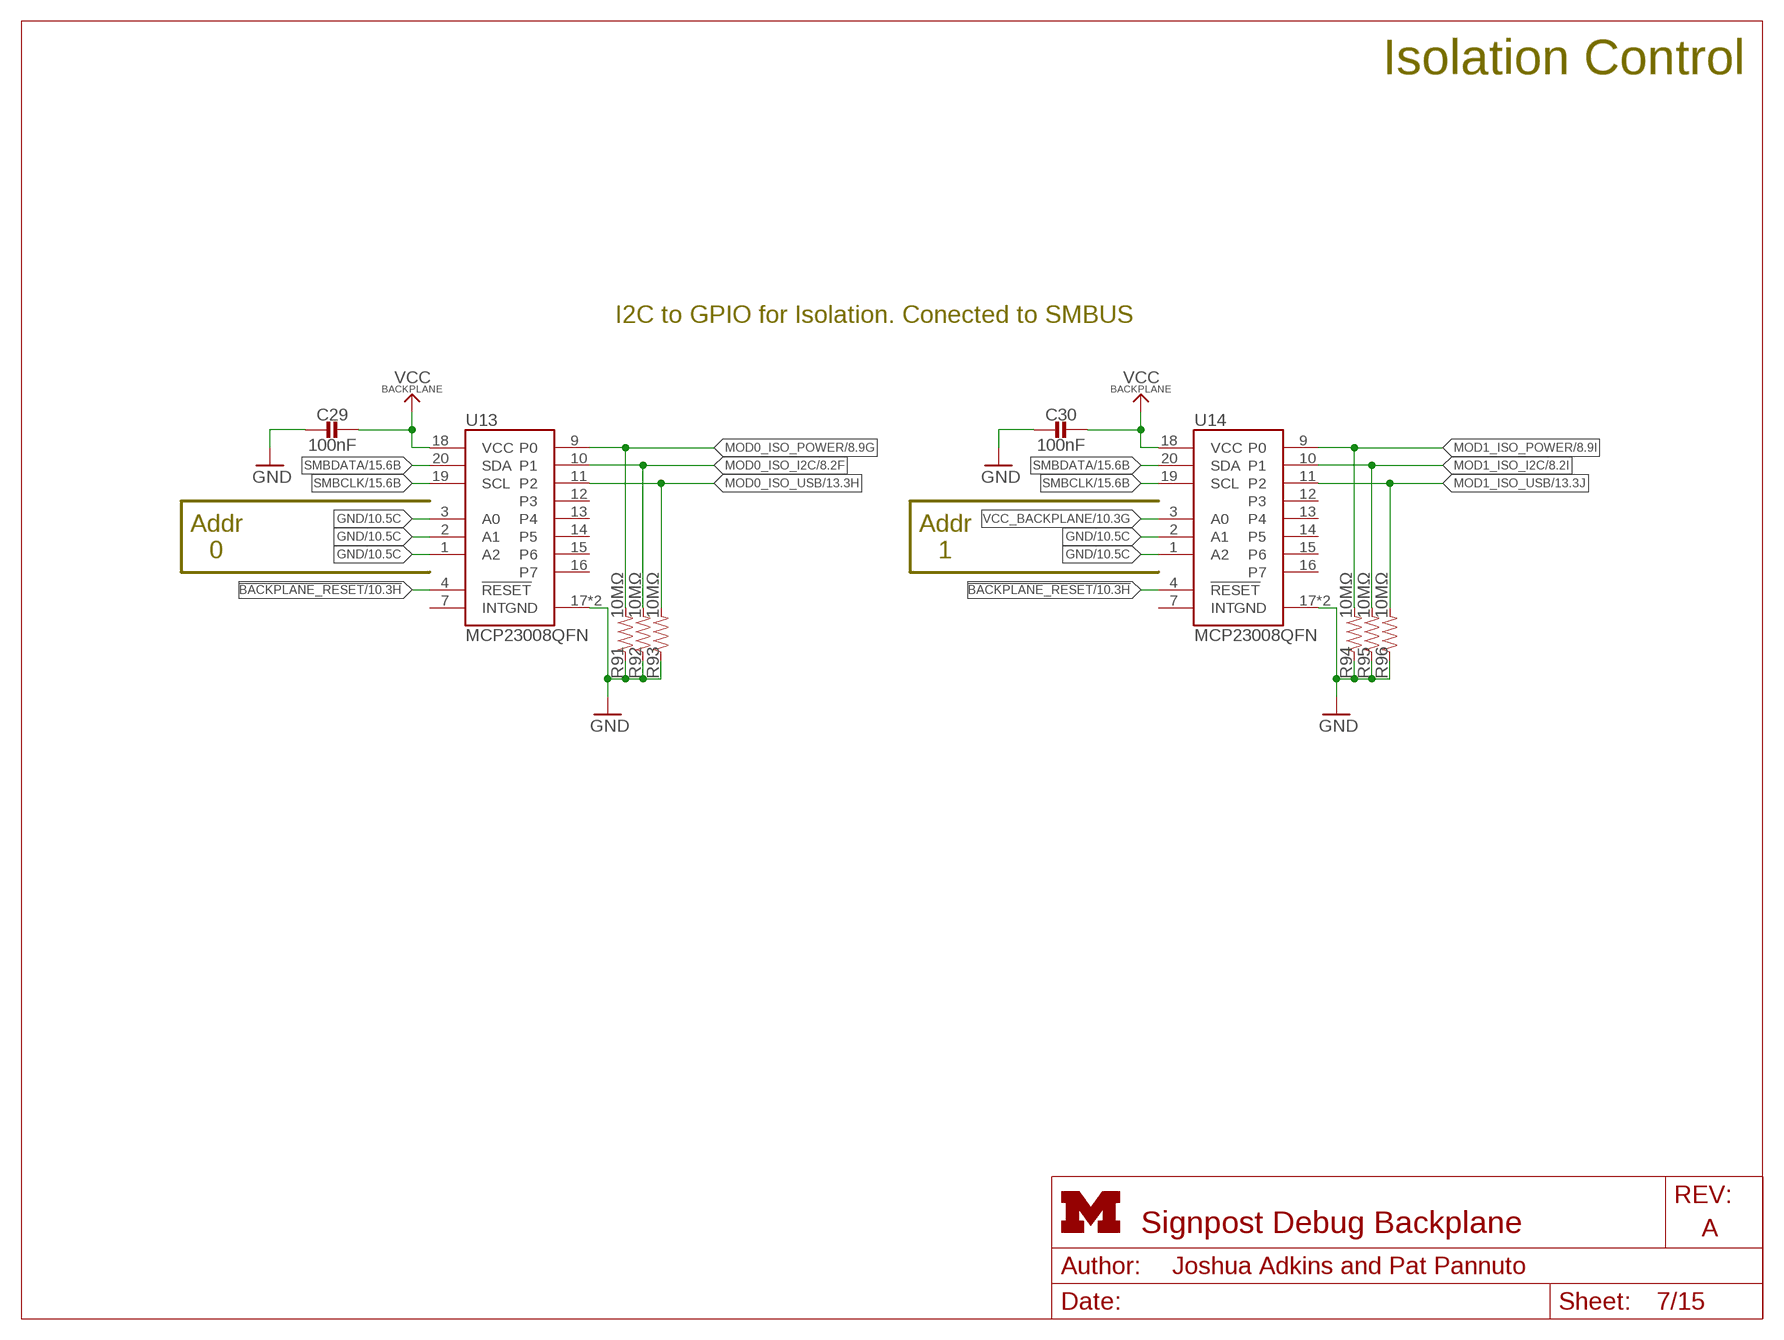
[diagram p6: schematic, sheet 7]
FRAME7 (LETTER_L_UMICH): HEIGHT: 8.5in; WIDTH: 11in

### Parts
C29  100nF  CAPACITOR0603_CAP  [0603_CAP]
C30  100nF  CAPACITOR0603_CAP  [0603_CAP]
R91  10MΩ  RESISTOR0603_RES  [0603-RES]
R92  10MΩ  RESISTOR0603_RES  [0603-RES]
R93  10MΩ  RESISTOR0603_RES  [0603-RES]
R94  10MΩ  RESISTOR0603_RES  [0603-RES]
R95  10MΩ  RESISTOR0603_RES  [0603-RES]
R96  10MΩ  RESISTOR0603_RES  [0603-RES]
U13  MCP23008QFN  [QFN-20-4MM]
U14  MCP23008QFN  [QFN-20-4MM]

### Nets
!BACKPLANE_RESET: U13.4(!RESET) U14.4(!RESET) ; also sheet 1,10,15
GND: C29.2 C30.2 R91.1 R92.1 R93.1 R94.1 R95.1 R96.1 U13.1(A2) U13.2(A1) U13.3(A0) U13.17(GND) U13.GND U14.1(A2) U14.2(A1) U14.17(GND) U14.GND ; also sheet 1,2,3,4,5,6,8,9,10,11,12,13,14,15
MOD0_ISO_I2C: R92.2 U13.10(P1) ; also sheet 8,15
MOD0_ISO_POWER: R91.2 U13.9(P0) ; also sheet 8,15
MOD0_ISO_USB: R93.2 U13.11(P2) ; also sheet 13,15
MOD1_ISO_I2C: R95.2 U14.10(P1) ; also sheet 8,15
MOD1_ISO_POWER: R94.2 U14.9(P0) ; also sheet 8,15
MOD1_ISO_USB: R96.2 U14.11(P2) ; also sheet 13,15
SMBCLK: U13.19(SCL) U14.19(SCL) ; also sheet 1,2,15
SMBDATA: U13.20(SDA) U14.20(SDA) ; also sheet 1,2,15
VCC_BACKPLANE: C29.1 C30.1 U13.18(VCC) U14.3(A0) U14.18(VCC) ; also sheet 1,2,8,9,10,11,12,13,15
Unconnected: U13.7(INT) U13.12(P3) U13.13(P4) U13.14(P5) U13.15(P6) U13.16(P7) U14.7(INT) U14.12(P3) U14.13(P4) U14.14(P5) U14.15(P6) U14.16(P7)

### Notes on the sheet
- Isolation Control
- I2C to GPIO for Isolation. Conected to SMBUS
- Addr
  0
- Addr
  1

## Sheet 8 of 15
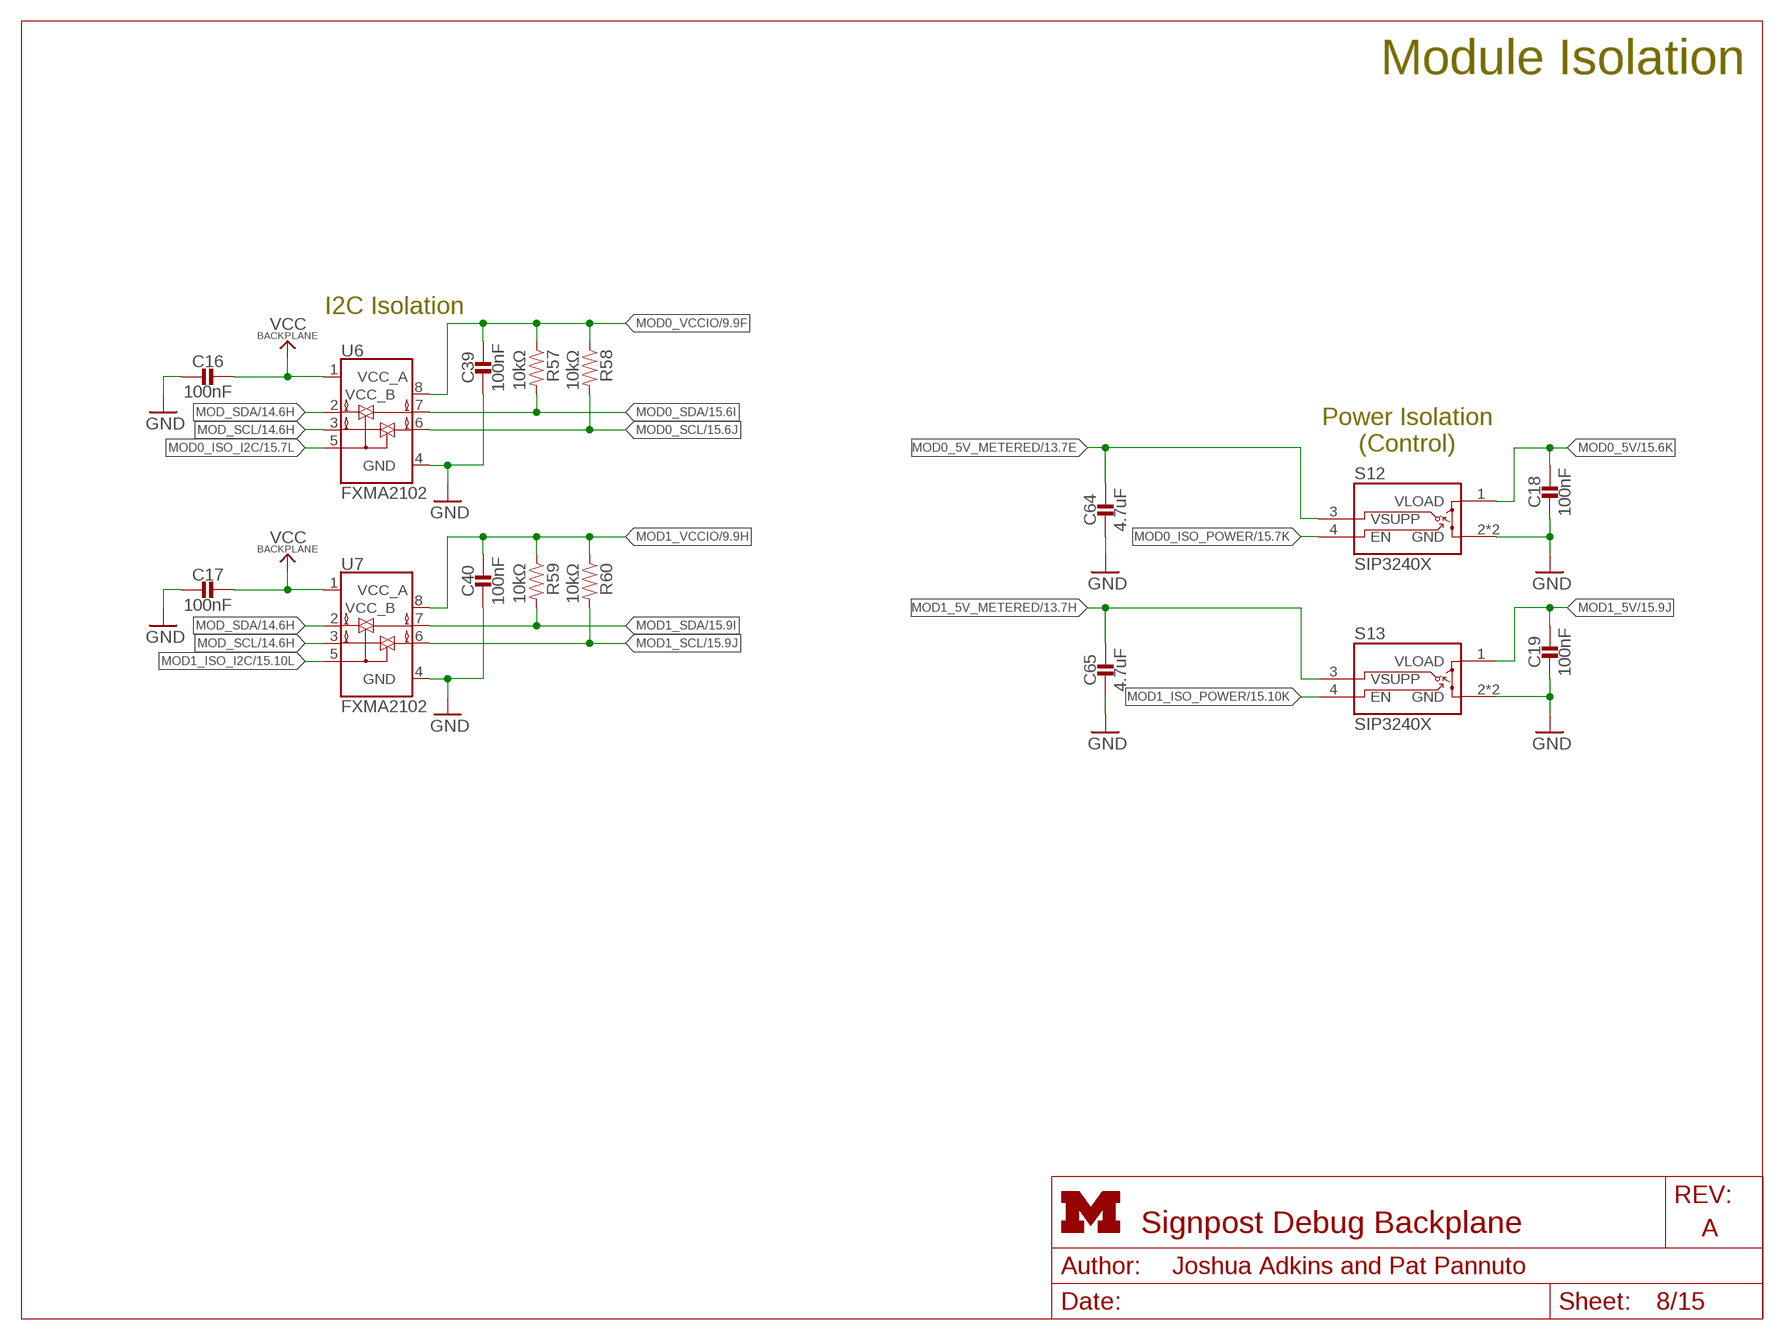
[diagram p7: schematic, sheet 8]
FRAME4 (LETTER_L): HEIGHT: 8.5in; WIDTH: 11in

### Parts
C16  100nF  CAPACITOR0603_CAP  [0603_CAP]
C17  100nF  CAPACITOR0603_CAP  [0603_CAP]
C18  100nF  CAPACITOR0603_CAP  [0603_CAP]
C19  100nF  CAPACITOR0603_CAP  [0603_CAP]
C39  100nF  CAPACITOR0603_CAP  [0603_CAP]
C40  100nF  CAPACITOR0603_CAP  [0603_CAP]
C64  4.7uF  CAPACITOR0603_CAP  [0603_CAP]
C65  4.7uF  CAPACITOR0603_CAP  [0603_CAP]
R57  10kΩ  RESISTOR0603_RES  [0603-RES]
R58  10kΩ  RESISTOR0603_RES  [0603-RES]
R59  10kΩ  RESISTOR0603_RES  [0603-RES]
R60  10kΩ  RESISTOR0603_RES  [0603-RES]
S12  SIP3240X  [TDFN4]
S13  SIP3240X  [TDFN4]
U6  FXMA2102  [UMLP-8]
U7  FXMA2102  [UMLP-8]

### Nets
GND: C16.2 C17.2 C18.2 C19.2 C39.2 C40.2 C64.2 C65.2 S12.2(GND) S12.PAD(GND) S13.2(GND) S13.PAD(GND) U6.4(GND) U7.4(GND) ; also sheet 1,2,3,4,5,6,7,9,10,11,12,13,14,15
MOD0_5V: C18.1 S12.1(VLOAD) ; also sheet 3,15
MOD0_5V_METERED: C64.1 S12.3(VSUPP) ; also sheet 2,13,15
MOD0_ISO_I2C: U6.5(OE) ; also sheet 7,15
MOD0_ISO_POWER: S12.4(EN) ; also sheet 7,15
MOD0_SCL: R58.2 U6.6(B1) ; also sheet 3,15
MOD0_SDA: R57.2 U6.7(B0) ; also sheet 3,15
MOD0_VCCIO: C39.1 R57.1 R58.1 U6.8(VCC_B) ; also sheet 3,4,5,9,15
MOD1_5V: C19.1 S13.1(VLOAD) ; also sheet 3,15
MOD1_5V_METERED: C65.1 S13.3(VSUPP) ; also sheet 2,13,15
MOD1_ISO_I2C: U7.5(OE) ; also sheet 7,15
MOD1_ISO_POWER: S13.4(EN) ; also sheet 7,15
MOD1_SCL: R60.2 U7.6(B1) ; also sheet 3,15
MOD1_SDA: R59.2 U7.7(B0) ; also sheet 3,15
MOD1_VCCIO: C40.1 R59.1 R60.1 U7.8(VCC_B) ; also sheet 3,4,5,9,15
MOD_SCL: U6.3(A1) U7.3(A1) ; also sheet 1,14,15
MOD_SDA: U6.2(A0) U7.2(A0) ; also sheet 1,14,15
VCC_BACKPLANE: C16.1 C17.1 U6.1(VCC_A) U7.1(VCC_A) ; also sheet 1,2,7,9,10,11,12,13,15

### Notes on the sheet
- Module Isolation
- I2C Isolation
- Power Isolation
  (Control)

## Sheet 9 of 15
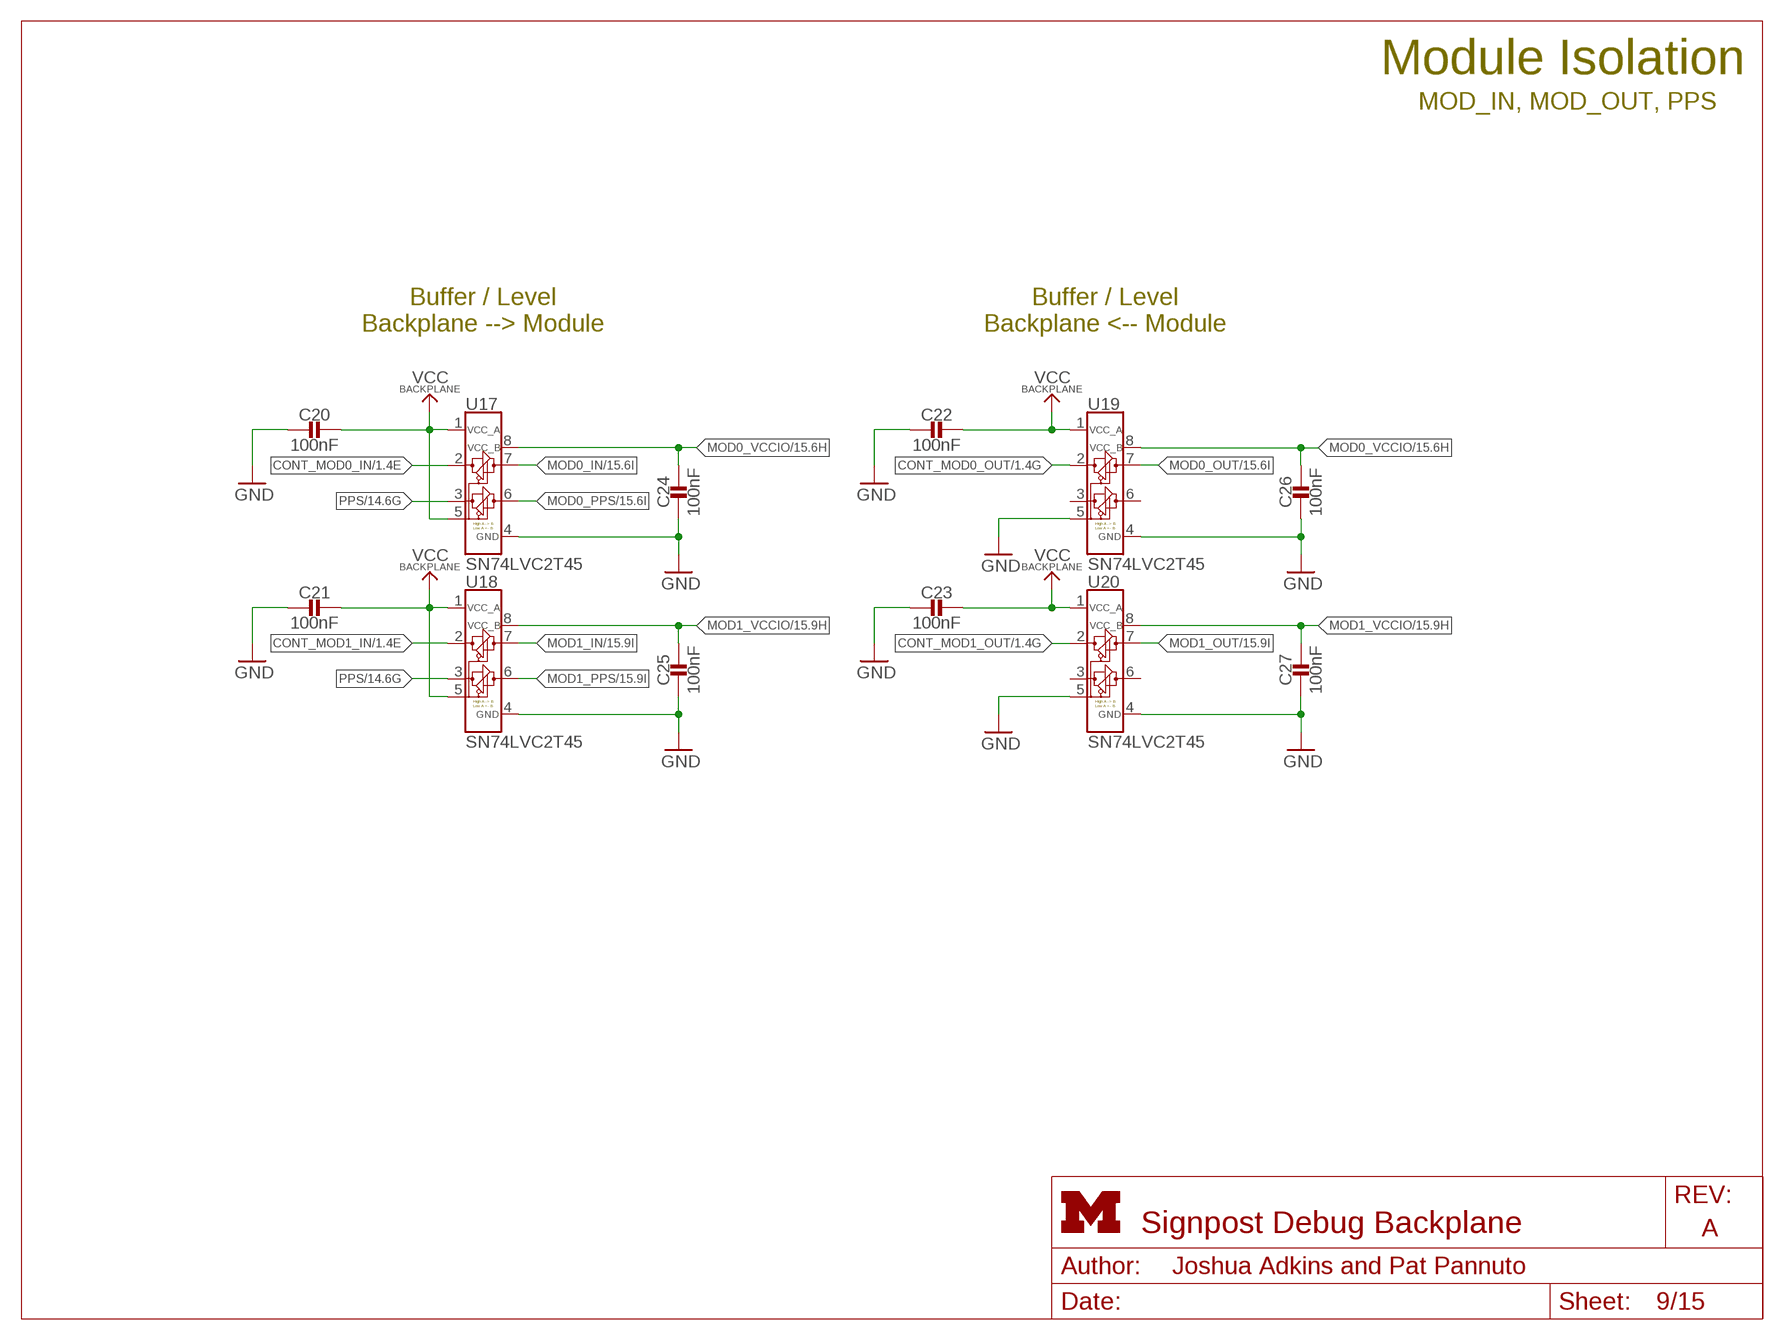
[diagram p8: schematic, sheet 9]
FRAME5 (LETTER_L_UMICH): HEIGHT: 8.5in; WIDTH: 11in

### Parts
C20  100nF  CAPACITOR0603_CAP  [0603_CAP]
C21  100nF  CAPACITOR0603_CAP  [0603_CAP]
C22  100nF  CAPACITOR0603_CAP  [0603_CAP]
C23  100nF  CAPACITOR0603_CAP  [0603_CAP]
C24  100nF  CAPACITOR0603_CAP  [0603_CAP]
C25  100nF  CAPACITOR0603_CAP  [0603_CAP]
C26  100nF  CAPACITOR0603_CAP  [0603_CAP]
C27  100nF  CAPACITOR0603_CAP  [0603_CAP]
U17  SN74LVC2T45  [VFSOP-8]
U18  SN74LVC2T45  [VFSOP-8]
U19  SN74LVC2T45  [VFSOP-8]
U20  SN74LVC2T45  [VFSOP-8]

### Nets
CONT_MOD0_IN: U17.2(A1) ; also sheet 1
CONT_MOD0_OUT: U19.2(A1) ; also sheet 1
CONT_MOD1_IN: U18.2(A1) ; also sheet 1
CONT_MOD1_OUT: U20.2(A1) ; also sheet 1
GND: C20.2 C21.2 C22.2 C23.2 C24.2 C25.2 C26.2 C27.2 U17.4(GND) U18.4(GND) U19.4(GND) U19.5(DIR) U20.4(GND) U20.5(DIR) ; also sheet 1,2,3,4,5,6,7,8,10,11,12,13,14,15
MOD0_IN: U17.7(B1) ; also sheet 3,15
MOD0_OUT: U19.7(B1) ; also sheet 3,15
MOD0_PPS: U17.6(B2) ; also sheet 3,15
MOD0_VCCIO: C24.1 C26.1 U17.8(VCC_B) U19.8(VCC_B) ; also sheet 3,4,5,8,15
MOD1_IN: U18.7(B1) ; also sheet 3,15
MOD1_OUT: U20.7(B1) ; also sheet 3,15
MOD1_PPS: U18.6(B2) ; also sheet 3,15
MOD1_VCCIO: C25.1 C27.1 U18.8(VCC_B) U20.8(VCC_B) ; also sheet 3,4,5,8,15
PPS: U17.3(A2) U18.3(A2) ; also sheet 1,14,15
VCC_BACKPLANE: C20.1 C21.1 C22.1 C23.1 U17.1(VCC_A) U17.5(DIR) U18.1(VCC_A) U18.5(DIR) U19.1(VCC_A) U20.1(VCC_A) ; also sheet 1,2,7,8,10,11,12,13,15
Unconnected: U19.3(A2) U19.6(B2) U20.3(A2) U20.6(B2)

### Notes on the sheet
- Module Isolation
- MOD_IN, MOD_OUT, PPS
- Buffer / Level
  Backplane --> Module
- Buffer / Level
  Backplane <-- Module

## Sheet 10 of 15
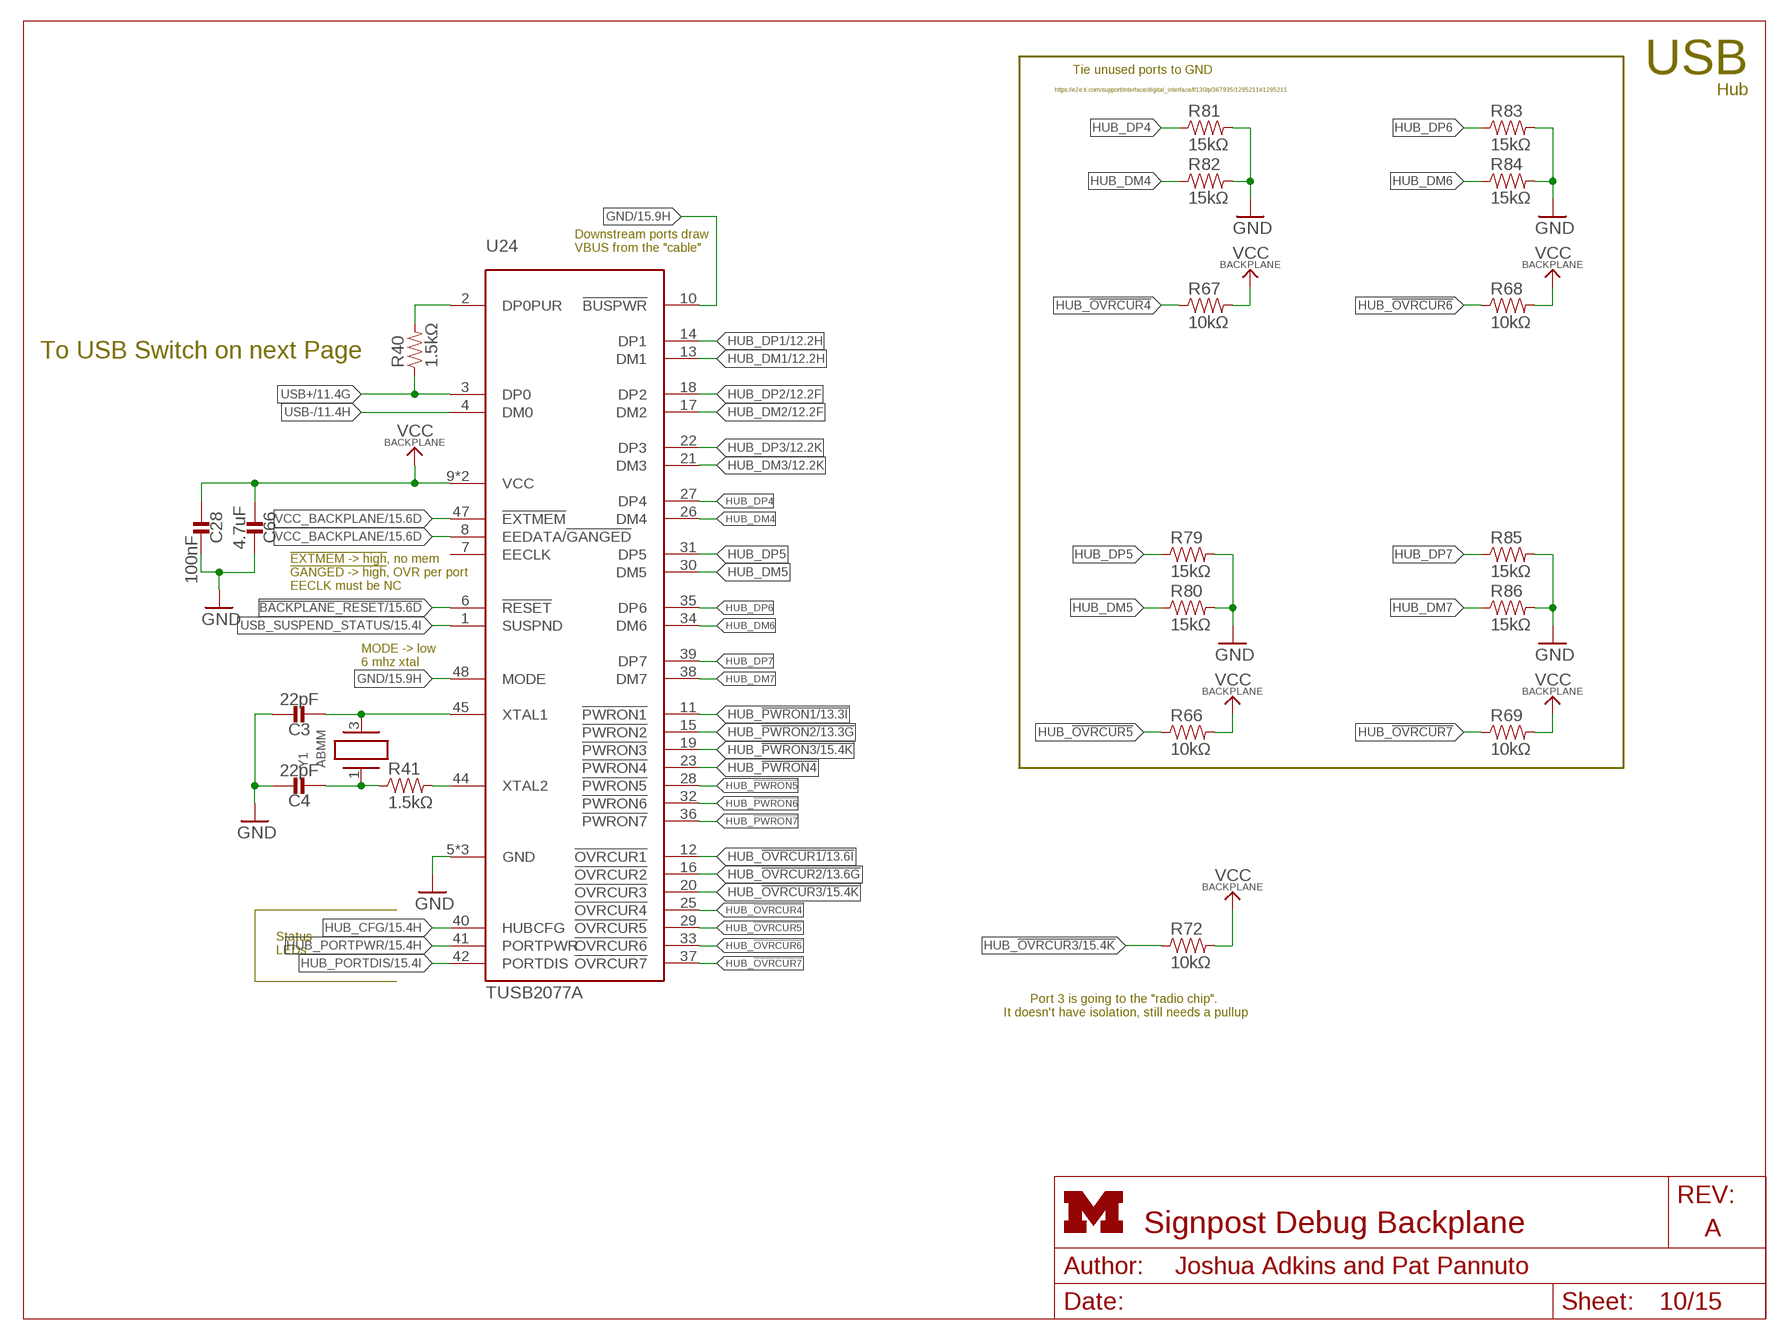
[diagram p9: schematic, sheet 10]
FRAME8 (LETTER_L_UMICH): HEIGHT: 8.5in; WIDTH: 11in

### Parts
C3  22pF  CAPACITOR0603_CAP  [0603_CAP]
C4  22pF  CAPACITOR0603_CAP  [0603_CAP]
C28  100nF  CAPACITOR0603_CAP  [0603_CAP]
C66  4.7uF  CAPACITOR0603_CAP  [0603_CAP]
R40  1.5kΩ  RESISTOR0603_RES  [0603-RES]
R41  1.5kΩ  RESISTOR0603_RES  [0603-RES]
R66  10kΩ  RESISTOR0603_RES  [0603-RES]
R67  10kΩ  RESISTOR0603_RES  [0603-RES]
R68  10kΩ  RESISTOR0603_RES  [0603-RES]
R69  10kΩ  RESISTOR0603_RES  [0603-RES]
R72  10kΩ  RESISTOR0603_RES  [0603-RES]
R79  15kΩ  RESISTOR0603_RES  [0603-RES]
R80  15kΩ  RESISTOR0603_RES  [0603-RES]
R81  15kΩ  RESISTOR0603_RES  [0603-RES]
R82  15kΩ  RESISTOR0603_RES  [0603-RES]
R83  15kΩ  RESISTOR0603_RES  [0603-RES]
R84  15kΩ  RESISTOR0603_RES  [0603-RES]
R85  15kΩ  RESISTOR0603_RES  [0603-RES]
R86  15kΩ  RESISTOR0603_RES  [0603-RES]
U24  TUSB2077A  [LQFP-48]
Y1  ABMM  [ABMM]

### Nets
!BACKPLANE_RESET: U24.6(!RESET) ; also sheet 1,7,15
GND: C3.1 C4.1 C28.1 C66.1 R79.2 R80.2 R81.2 R82.2 R83.2 R84.2 R85.2 R86.2 U24.5(GND) U24.10(!BUSPWR) U24.24(GND) U24.43(GND) U24.48(MODE) ; also sheet 1,2,3,4,5,6,7,8,9,11,12,13,14,15
HUB_!OVRCUR1: U24.12(!OVRCUR1) ; also sheet 13,15
HUB_!OVRCUR2: U24.16(!OVRCUR2) ; also sheet 13,15
HUB_!OVRCUR3: R72.1 U24.20(!OVRCUR3) ; also sheet 15
HUB_!OVRCUR4: R67.1 U24.25(!OVRCUR4)
HUB_!OVRCUR5: R66.1 U24.29(!OVRCUR5)
HUB_!OVRCUR6: R68.1 U24.33(!OVRCUR6)
HUB_!OVRCUR7: R69.1 U24.37(!OVRCUR7)
HUB_!PWRON1: U24.11(!PWRON1) ; also sheet 13,15
HUB_!PWRON2: U24.15(!PWRON2) ; also sheet 13,15
HUB_!PWRON3: U24.19(!PWRON3) ; also sheet 15
HUB_!PWRON4: U24.23(!PWRON4)
HUB_!PWRON5: U24.28(!PWRON5)
HUB_!PWRON6: U24.32(!PWRON6)
HUB_!PWRON7: U24.36(!PWRON7)
HUB_CFG: U24.40(HUBCFG) ; also sheet 15
HUB_DM1: U24.13(DM1) ; also sheet 12
HUB_DM2: U24.17(DM2) ; also sheet 12
HUB_DM3: U24.21(DM3) ; also sheet 12
HUB_DM4: R82.1 U24.26(DM4)
HUB_DM5: R80.1 U24.30(DM5)
HUB_DM6: R84.1 U24.34(DM6)
HUB_DM7: R86.1 U24.38(DM7)
HUB_DP1: U24.14(DP1) ; also sheet 12
HUB_DP2: U24.18(DP2) ; also sheet 12
HUB_DP3: U24.22(DP3) ; also sheet 12
HUB_DP4: R81.1 U24.27(DP4)
HUB_DP5: R79.1 U24.31(DP5)
HUB_DP6: R83.1 U24.35(DP6)
HUB_DP7: R85.1 U24.39(DP7)
HUB_PORTDIS: U24.42(PORTDIS) ; also sheet 15
HUB_PORTPWR: U24.41(PORTPWR) ; also sheet 15
N$12: R40.2 U24.2(DP0PUR)
N$14: C4.2 R41.1 Y1.1
N$73: C3.2 U24.45(XTAL1) Y1.3
N$74: R41.2 U24.44(XTAL2)
USB+: R40.1 U24.3(DP0) ; also sheet 11
USB-: U24.4(DM0) ; also sheet 11
USB_SUSPEND_STATUS: U24.1(SUSPND) ; also sheet 15
VCC_BACKPLANE: C28.2 C66.2 R66.2 R67.2 R68.2 R69.2 R72.2 U24.8(EEDATA/!GANGED) U24.9(VCC) U24.46(VCC) U24.47(!EXTMEM) ; also sheet 1,2,7,8,9,11,12,13,15
Unconnected: U24.7(EECLK)

### Notes on the sheet
- USB
- Tie unused ports to GND
- Hub
- https://e2e.ti.com/support/interface/digital_interface/f/130/p/367935/1295211#1295211
- Downstream ports draw
  VBUS from the "cable"
- To USB Switch on next Page
- !EXTMEM -> high, no mem
  !GANGED -> high, OVR per port
  EECLK must be NC
- MODE -> low
  6 mhz xtal
- Status
  LEDs
- Port 3 is going to the "radio chip". 
  It doesn't have isolation, still needs a pullup

## Sheet 11 of 15
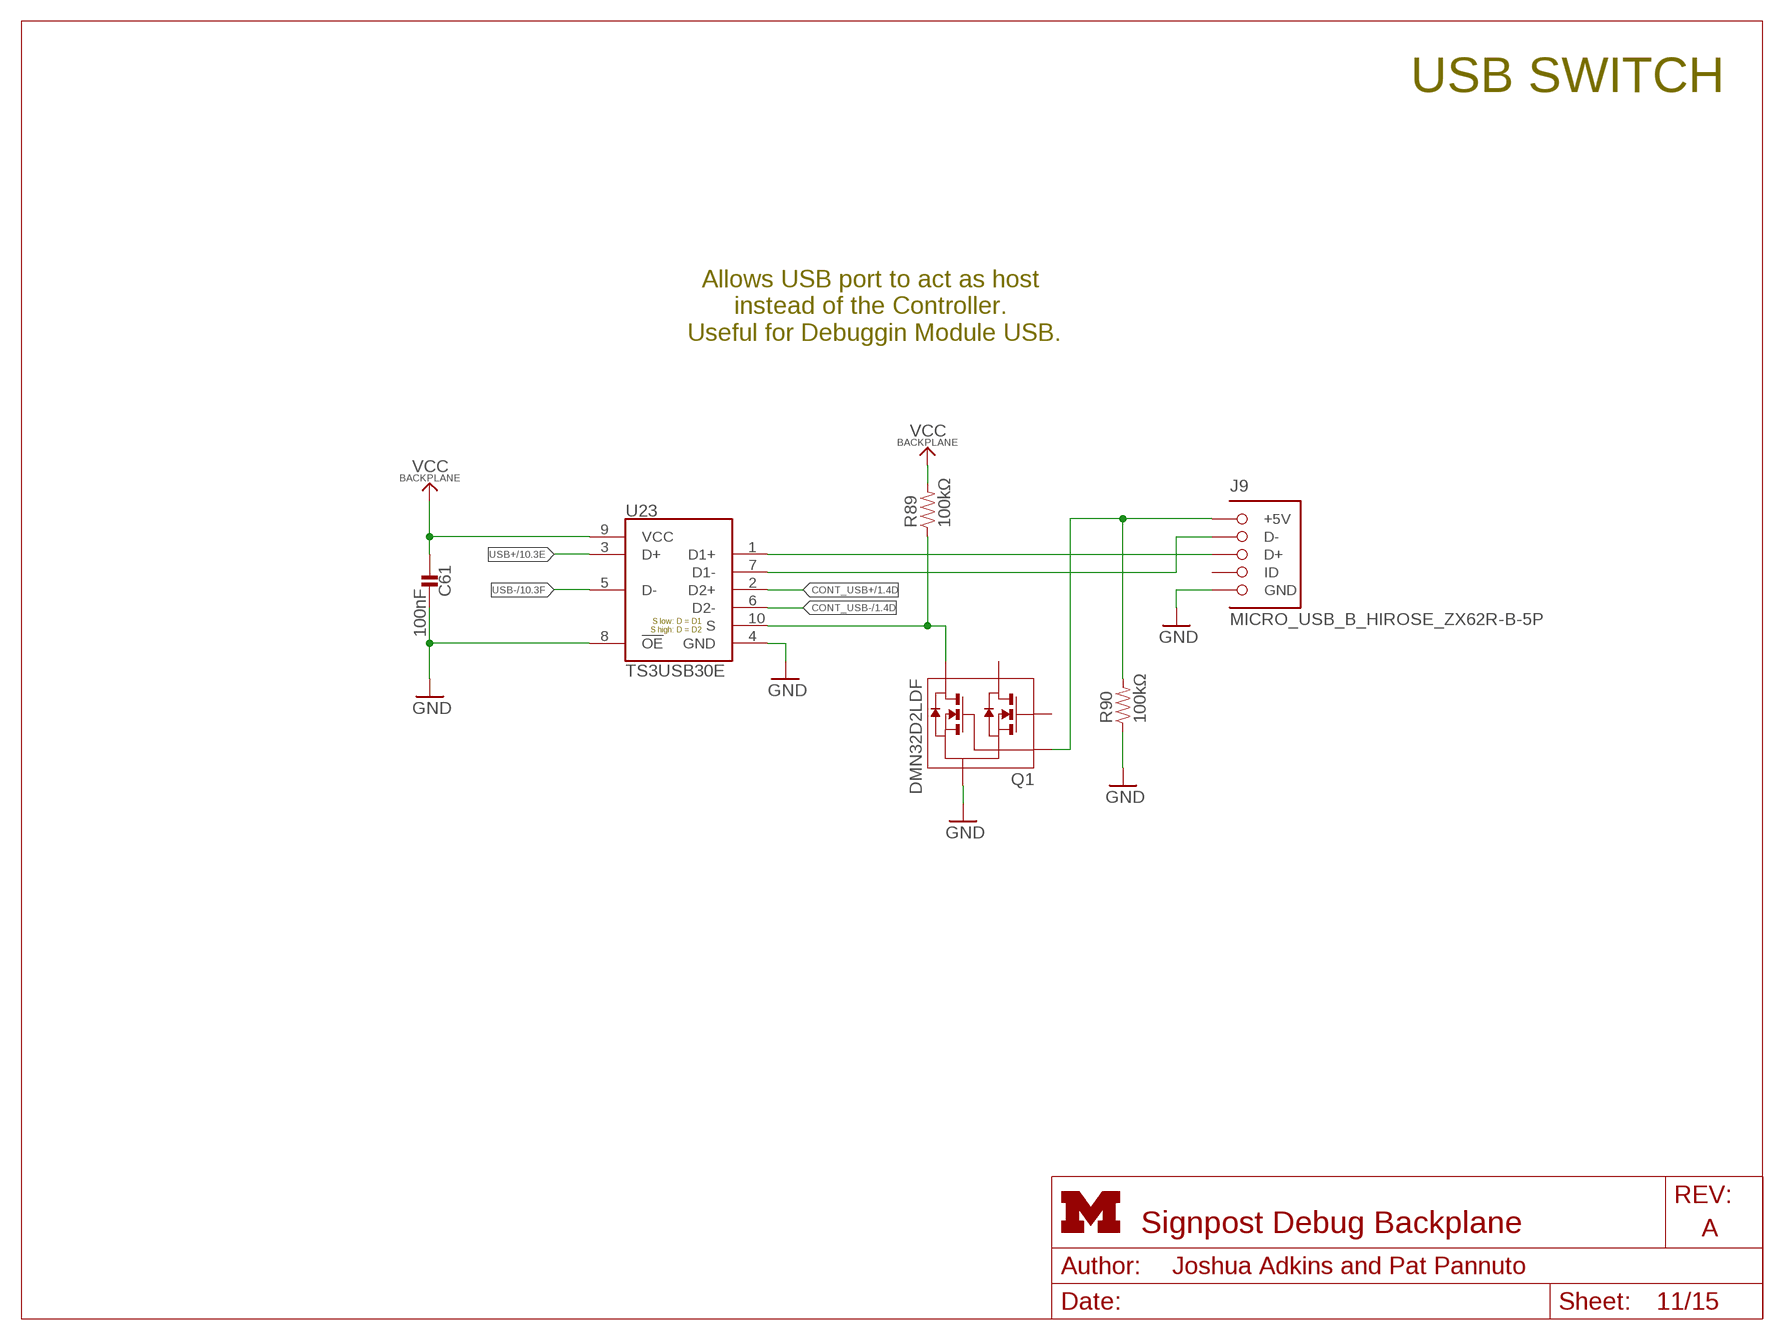
[diagram p10: schematic, sheet 11]
FRAME14 (LETTER_L_UMICH): HEIGHT: 8.5in; WIDTH: 11in

### Parts
C61  100nF  CAPACITOR0603_CAP  [0603_CAP]
J9  MICRO_USB_B_HIROSE_ZX62R-B-5P  [USB_MICRO_B-HIROSE-ZX62R-B-5P]
Q1  DMN32D2LDF  [SOT353]
R89  100kΩ  RESISTOR0603_RES  [0603-RES]
R90  100kΩ  RESISTOR0603_RES  [0603-RES]
U23  TS3USB30E  [UQFN-10]

### Nets
CONT_USB+: U23.2(D2+) ; also sheet 1
CONT_USB-: U23.6(D2-) ; also sheet 1
GND: C61.1 J9.5(GND) Q1.S R90.1 U23.4(GND) U23.8(!OE) ; also sheet 1,2,3,4,5,6,7,8,9,10,12,13,14,15
N$25: J9.1(+5V) Q1.G2 R90.2
N$33: Q1.D2 R89.1 U23.10(S)
N$66: J9.3(D+) U23.1(D1+)
N$81: J9.2(D-) U23.7(D1-)
USB+: U23.3(D+) ; also sheet 10
USB-: U23.5(D-) ; also sheet 10
VCC_BACKPLANE: C61.2 R89.2 U23.9(VCC) ; also sheet 1,2,7,8,9,10,12,13,15
Unconnected: J9.4(ID) Q1.D1 Q1.G1

### Notes on the sheet
- USB SWITCH
- Allows USB port to act as host 
  instead of the Controller. 
  Useful for Debuggin Module USB.

## Sheet 12 of 15
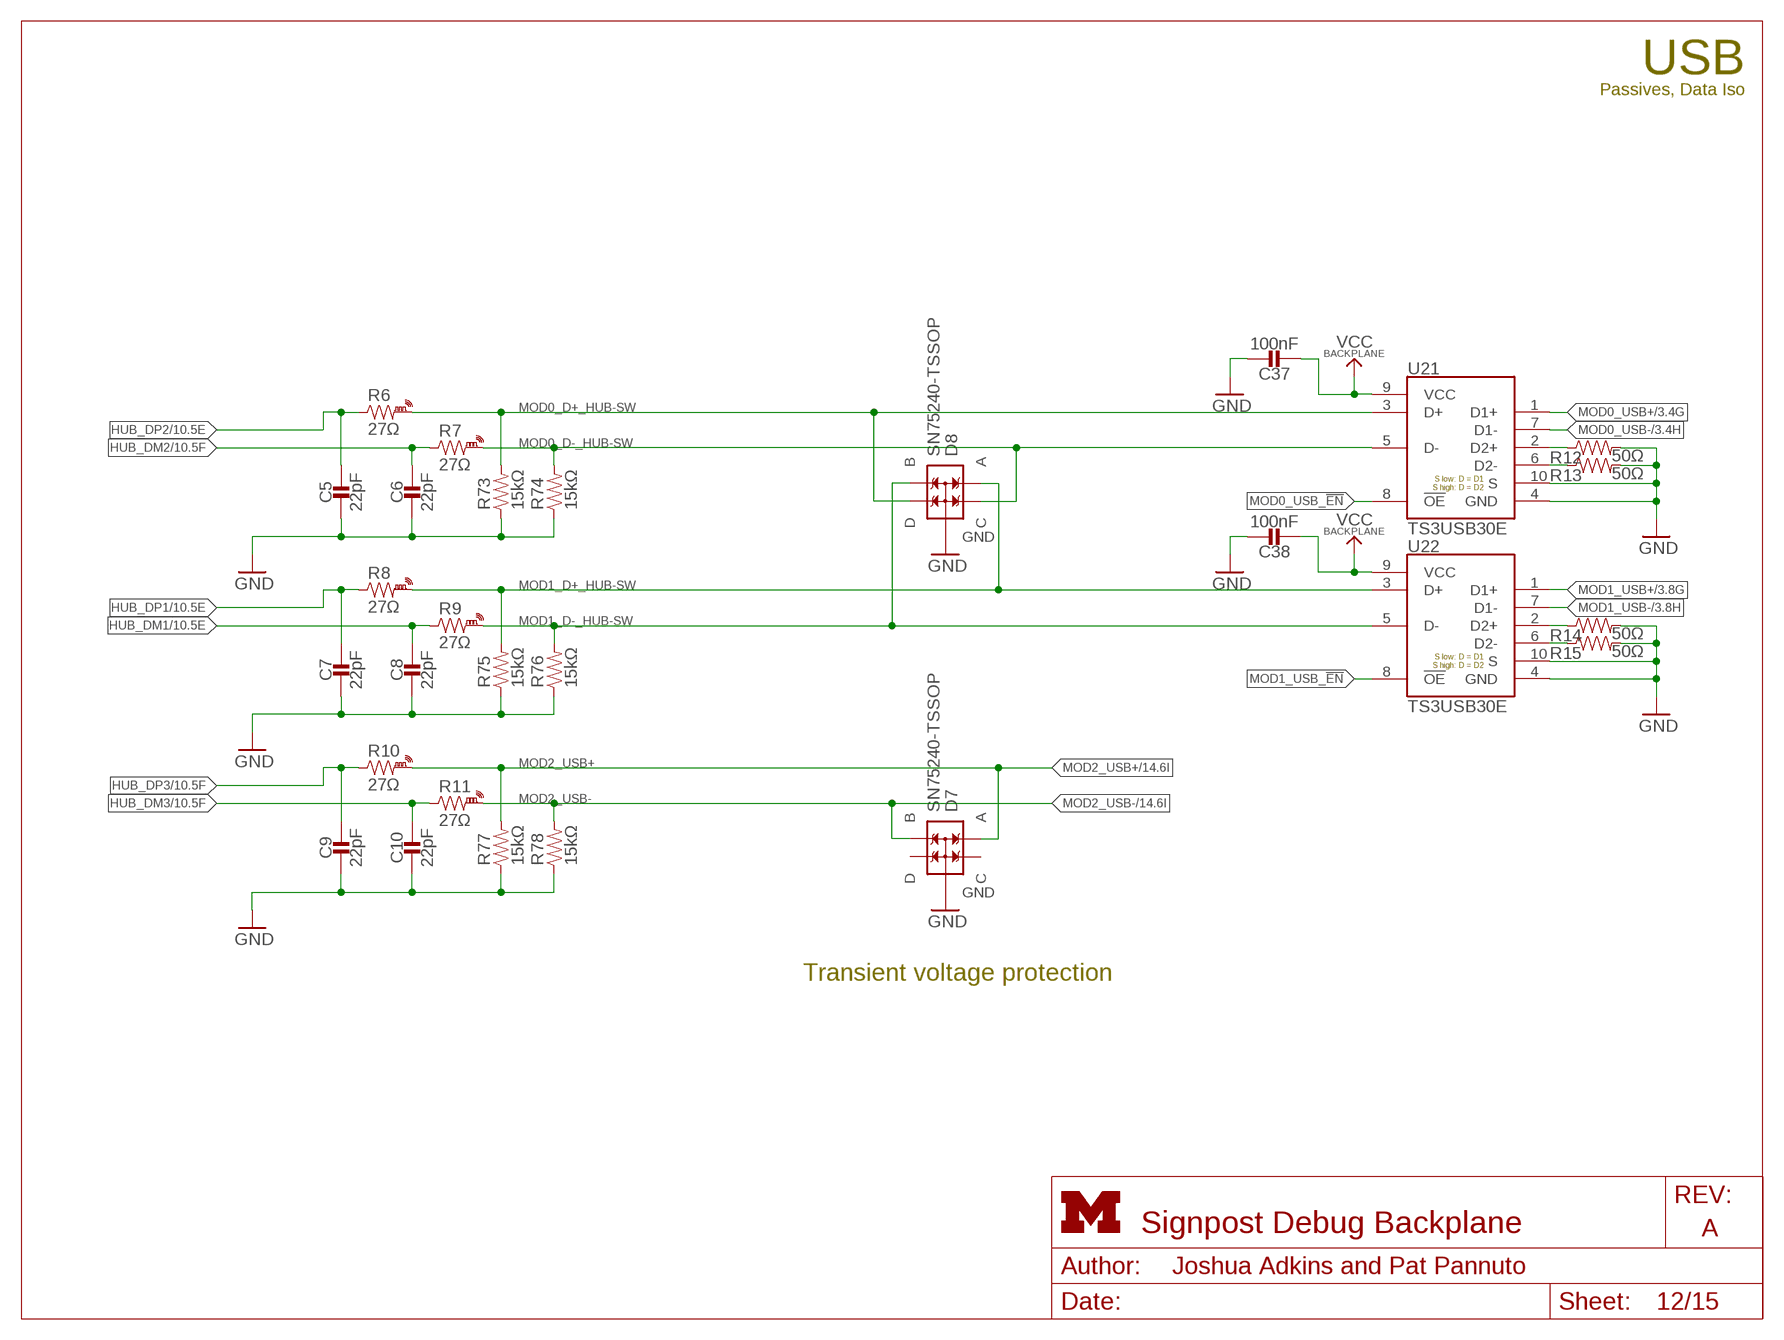
[diagram p11: schematic, sheet 12]
FRAME3 (LETTER_L): HEIGHT: 8.5in; WIDTH: 11in

### Parts
C5  22pF  CAPACITOR0402_CAP  [0402_CAP]
C6  22pF  CAPACITOR0402_CAP  [0402_CAP]
C7  22pF  CAPACITOR0402_CAP  [0402_CAP]
C8  22pF  CAPACITOR0402_CAP  [0402_CAP]
C9  22pF  CAPACITOR0402_CAP  [0402_CAP]
C10  22pF  CAPACITOR0402_CAP  [0402_CAP]
C37  100nF  CAPACITOR0603_CAP  [0603_CAP]
C38  100nF  CAPACITOR0603_CAP  [0603_CAP]
D7  SN75240-TSSOP  [TSSOP-8]
D8  SN75240-TSSOP  [TSSOP-8]
R6  27Ω  RESISTOR-HIGH_SPEED0402  [0402_RES-HIGH_SPEED]
R7  27Ω  RESISTOR-HIGH_SPEED0402  [0402_RES-HIGH_SPEED]
R8  27Ω  RESISTOR-HIGH_SPEED0402  [0402_RES-HIGH_SPEED]
R9  27Ω  RESISTOR-HIGH_SPEED0402  [0402_RES-HIGH_SPEED]
R10  27Ω  RESISTOR-HIGH_SPEED0402  [0402_RES-HIGH_SPEED]
R11  27Ω  RESISTOR-HIGH_SPEED0402  [0402_RES-HIGH_SPEED]
R12  50Ω  RESISTOR0603_RES  [0603-RES]
R13  50Ω  RESISTOR0603_RES  [0603-RES]
R14  50Ω  RESISTOR0603_RES  [0603-RES]
R15  50Ω  RESISTOR0603_RES  [0603-RES]
R73  15kΩ  RESISTOR0603_RES  [0603-RES]
R74  15kΩ  RESISTOR0603_RES  [0603-RES]
R75  15kΩ  RESISTOR0603_RES  [0603-RES]
R76  15kΩ  RESISTOR0603_RES  [0603-RES]
R77  15kΩ  RESISTOR0603_RES  [0603-RES]
R78  15kΩ  RESISTOR0603_RES  [0603-RES]
U21  TS3USB30E  [UQFN-10]
U22  TS3USB30E  [UQFN-10]

### Nets
GND: C5.2 C6.2 C7.2 C8.2 C9.2 C10.2 C37.1 C38.1 D7.1(GND) D7.3(GND) D7.5(GND) D7.7(GND) D8.1(GND) D8.3(GND) D8.5(GND) D8.7(GND) R12.2 R13.2 R14.2 R15.2 R73.1 R74.1 R75.1 R76.1 R77.1 R78.1 U21.4(GND) U21.10(S) U22.4(GND) U22.10(S) ; also sheet 1,2,3,4,5,6,7,8,9,10,11,13,14,15
HUB_DM1: C8.1 R9.2 ; also sheet 10
HUB_DM2: C6.1 R7.2 ; also sheet 10
HUB_DM3: C10.1 R11.2 ; also sheet 10
HUB_DP1: C7.1 R8.2 ; also sheet 10
HUB_DP2: C5.1 R6.2 ; also sheet 10
HUB_DP3: C9.1 R10.2 ; also sheet 10
MOD0_D+_HUB-SW: D8.4(D) R6.1 R73.2 U21.3(D+)
MOD0_D-_HUB-SW: D8.2(C) R7.1 R74.2 U21.5(D-)
MOD0_USB+: U21.1(D1+) ; also sheet 3
MOD0_USB-: U21.7(D1-) ; also sheet 3
MOD0_USB_!EN: U21.8(!OE) ; also sheet 13
MOD1_D+_HUB-SW: D8.8(A) R8.1 R75.2 U22.3(D+)
MOD1_D-_HUB-SW: D8.6(B) R9.1 R76.2 U22.5(D-)
MOD1_USB+: U22.1(D1+) ; also sheet 3
MOD1_USB-: U22.7(D1-) ; also sheet 3
MOD1_USB_!EN: U22.8(!OE) ; also sheet 13
MOD2_USB+: D7.8(A) R10.1 R77.2 ; also sheet 14
MOD2_USB-: D7.6(B) R11.1 R78.2 ; also sheet 14
N$17: R12.1 U21.2(D2+)
N$26: R15.1 U22.6(D2-)
N$27: R14.1 U22.2(D2+)
N$31: R13.1 U21.6(D2-)
VCC_BACKPLANE: C37.2 C38.2 U21.9(VCC) U22.9(VCC) ; also sheet 1,2,7,8,9,10,11,13,15
Unconnected: D7.2(C) D7.4(D)

### Notes on the sheet
- USB
- Passives, Data Iso
- Transient voltage protection

## Sheet 13 of 15
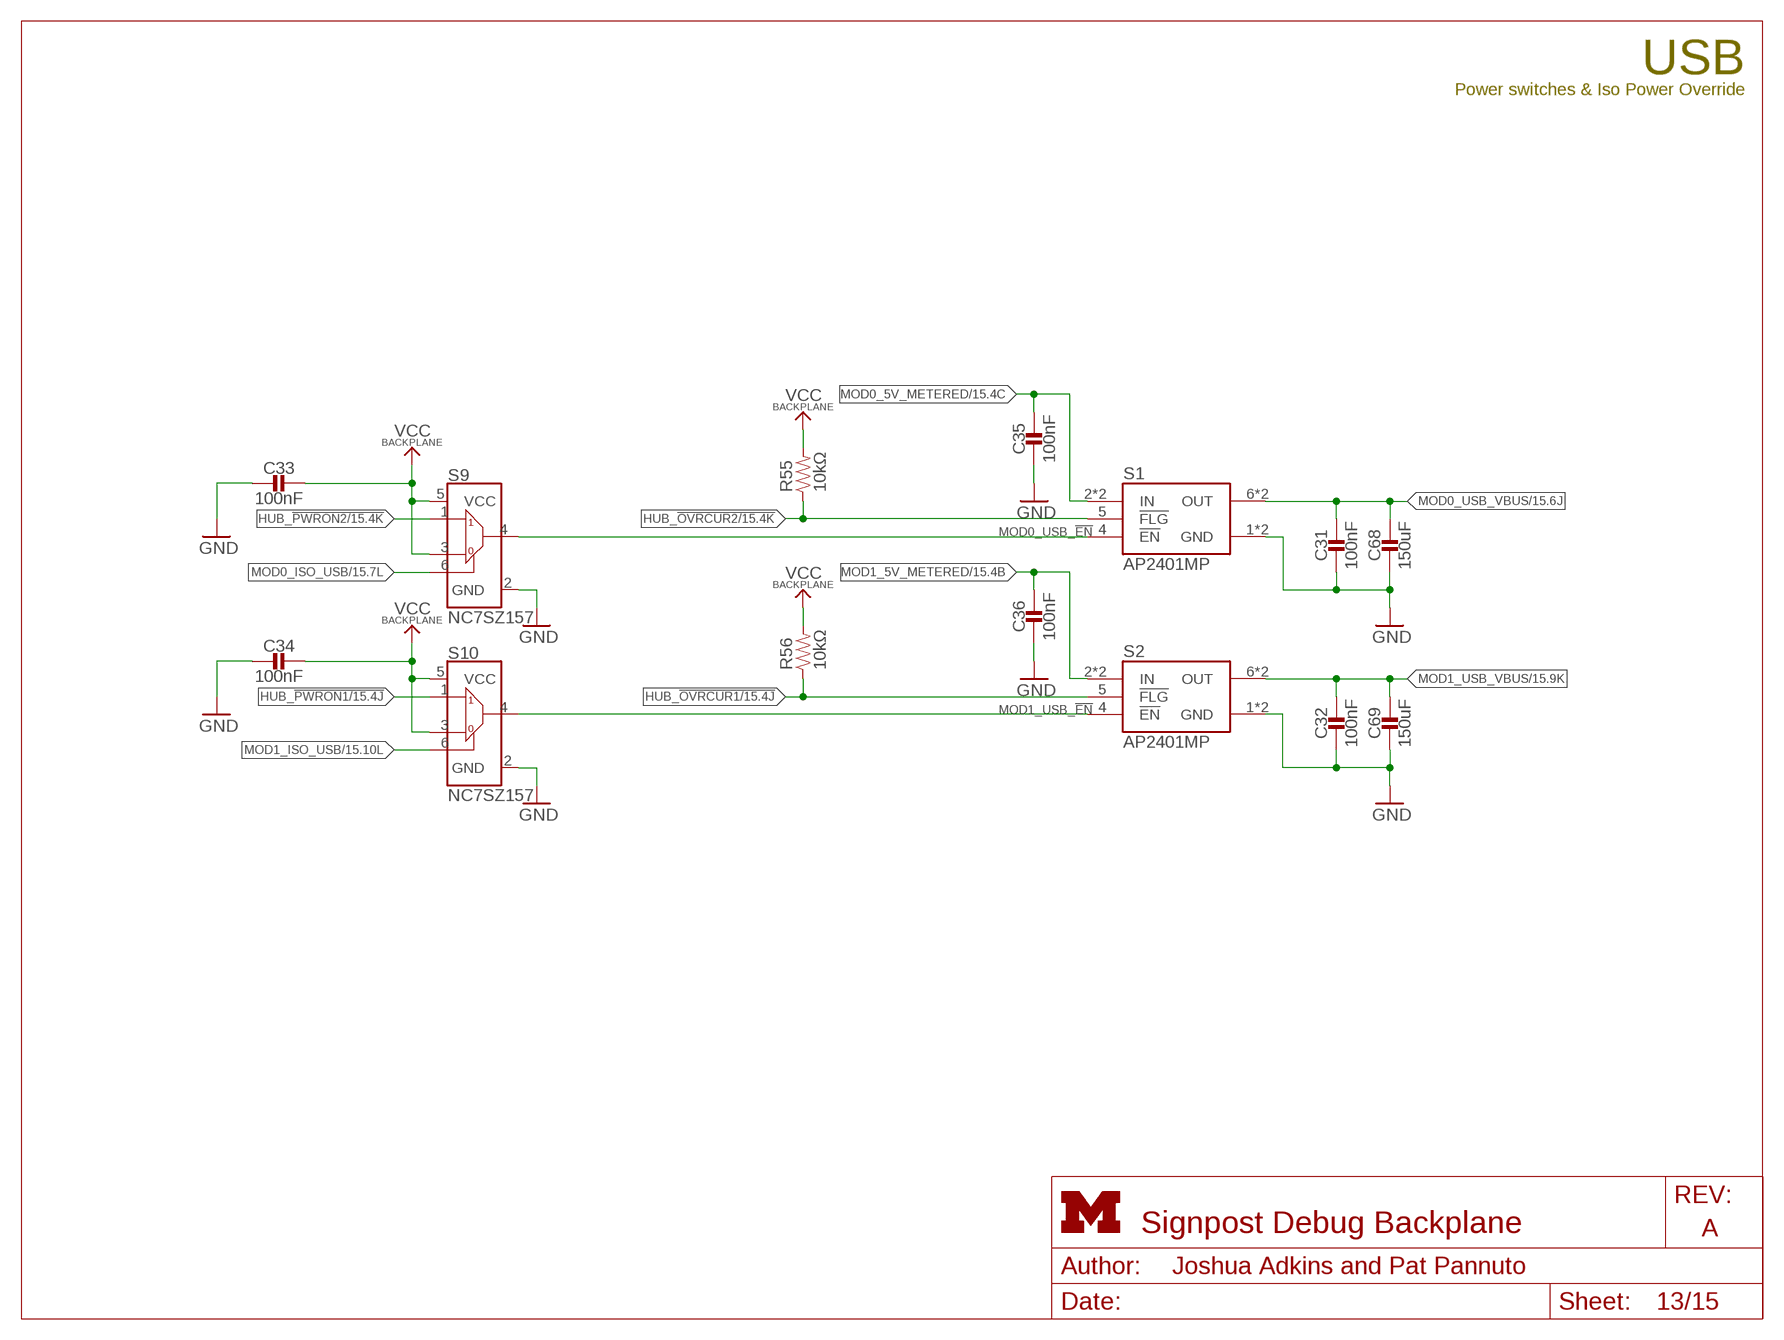
[diagram p12: schematic, sheet 13]
FRAME6 (LETTER_L_UMICH): HEIGHT: 8.5in; WIDTH: 11in

### Parts
C31  100nF  CAPACITOR0603_CAP  [0603_CAP]
C32  100nF  CAPACITOR0603_CAP  [0603_CAP]
C33  100nF  CAPACITOR0603_CAP  [0603_CAP]
C34  100nF  CAPACITOR0603_CAP  [0603_CAP]
C35  100nF  CAPACITOR0603_CAP  [0603_CAP]
C36  100nF  CAPACITOR0603_CAP  [0603_CAP]
C68  150uF  CAPACITOR1210_CAP  [1210_CAP]
C69  150uF  CAPACITOR1210_CAP  [1210_CAP]
R55  10kΩ  RESISTOR0603_RES  [0603-RES]
R56  10kΩ  RESISTOR0603_RES  [0603-RES]
S1  AP2401MP  [MSOP-8EP]
S2  AP2401MP  [MSOP-8EP]
S9  NC7SZ157  [SC70-6]
S10  NC7SZ157  [SC70-6]

### Nets
GND: C31.2 C32.2 C33.2 C34.2 C35.2 C36.2 C68.2 C69.2 S1.1(GND) S1.PAD(GND) S2.1(GND) S2.PAD(GND) S9.2(GND) S10.2(GND) ; also sheet 1,2,3,4,5,6,7,8,9,10,11,12,14,15
HUB_!OVRCUR1: R56.1 S2.5(!FLG) ; also sheet 10,15
HUB_!OVRCUR2: R55.1 S1.5(!FLG) ; also sheet 10,15
HUB_!PWRON1: S10.1(I1) ; also sheet 10,15
HUB_!PWRON2: S9.1(I1) ; also sheet 10,15
MOD0_5V_METERED: C35.1 S1.2(IN) S1.3(IN) ; also sheet 2,8,15
MOD0_ISO_USB: S9.6(S) ; also sheet 7,15
MOD0_USB_!EN: S1.4(!EN) S9.4(Z) ; also sheet 12
MOD0_USB_VBUS: C31.1 C68.1 S1.6(OUT) S1.7(OUT) ; also sheet 3,15
MOD1_5V_METERED: C36.1 S2.2(IN) S2.3(IN) ; also sheet 2,8,15
MOD1_ISO_USB: S10.6(S) ; also sheet 7,15
MOD1_USB_!EN: S2.4(!EN) S10.4(Z) ; also sheet 12
MOD1_USB_VBUS: C32.1 C69.1 S2.6(OUT) S2.7(OUT) ; also sheet 3,15
VCC_BACKPLANE: C33.1 C34.1 R55.2 R56.2 S9.3(I0) S9.5(VCC) S10.3(I0) S10.5(VCC) ; also sheet 1,2,7,8,9,10,11,12,15

### Notes on the sheet
- USB
- Power switches & Iso Power Override

## Sheet 14 of 15
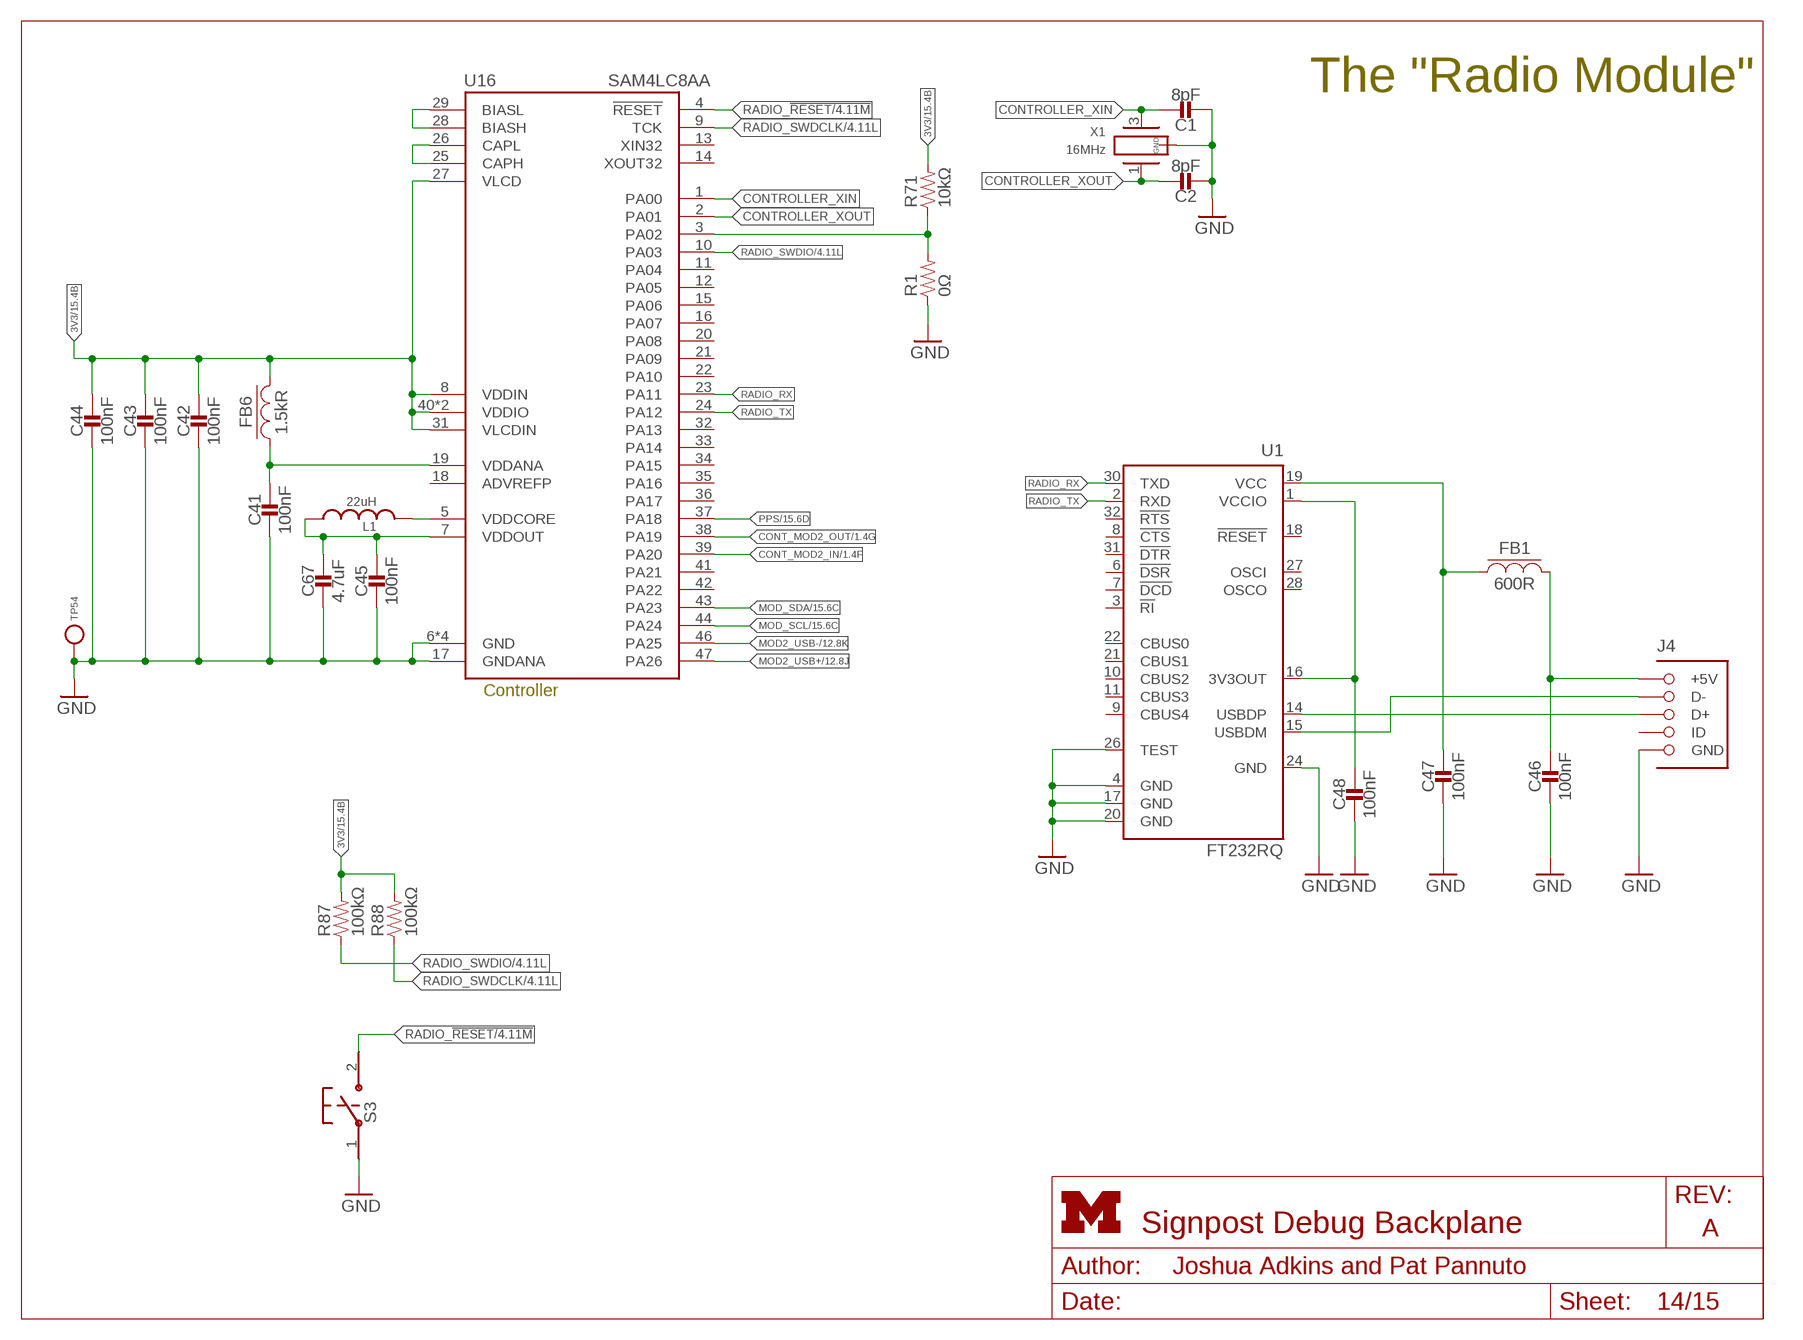
[diagram p13: schematic, sheet 14]
FRAME11 (LETTER_L_UMICH): HEIGHT: 8.5in; WIDTH: 11in

### Parts
C1  8pF  CAPACITOR0603_CAP  [0603_CAP]
C2  8pF  CAPACITOR0603_CAP  [0603_CAP]
C41  100nF  CAPACITOR0603_CAP  [0603_CAP]
C42  100nF  CAPACITOR0603_CAP  [0603_CAP]
C43  100nF  CAPACITOR0603_CAP  [0603_CAP]
C44  100nF  CAPACITOR0603_CAP  [0603_CAP]
C45  100nF  CAPACITOR0402_CAP  [0402_CAP]
C46  100nF  CAPACITOR0603_CAP  [0603_CAP]
C47  100nF  CAPACITOR0603_CAP  [0603_CAP]
C48  100nF  CAPACITOR0603_CAP  [0603_CAP]
C67  4.7uF  CAPACITOR0402_CAP  [0402_CAP]
FB1  600R  FERRITE_BEAD0603  [0603_CAP]
FB6  1.5kR  FERRITE_BEAD0603  [0603_CAP]
J4  MICRO_USB_B_HIROSE_ZX62R-B-5P  [USB_MICRO_B-HIROSE-ZX62R-B-5P]
L1  22uH  LHQ3NP  [1212]
R1  0Ω  RESISTOR0603_RES  [0603-RES]
R71  10kΩ  RESISTOR0603_RES  [0603-RES]
R87  100kΩ  RESISTOR0603_RES  [0603-RES]
R88  100kΩ  RESISTOR0603_RES  [0603-RES]
S3  B3U-1000P  [B3U-1000P]
TP54  TEST_POINT_0.040IN  [TESTPOINT_0.040IN]
U1  FT232RQ  [QFN32]
U16  SAM4LC8AA  [QFN-48-7MM]
X1  16MHz  FH1600015  [FHXXX]

### Nets
3V3: C42.1 C43.1 C44.1 FB6.2 R71.2 R87.2 R88.2 U16.8(VDDIN) U16.27(VLCD) U16.31(VLCDIN) U16.40(VDDIO) U16.45(VDDIO) ; also sheet 2,4,5,6,15
CONT_MOD2_IN: U16.39(PA20) ; also sheet 1
CONT_MOD2_OUT: U16.38(PA19) ; also sheet 1
CONTROLLER_BUCK/LDO_N: R1.2 R71.1 U16.3(PA02)
CONTROLLER_XIN: C1.1 U16.1(PA00) X1.3
CONTROLLER_XOUT: C2.1 U16.2(PA01) X1.1
GND: C1.2 C2.2 C41.2 C42.2 C43.2 C44.2 C45.2 C46.2 C47.2 C48.2 C67.2 J4.5(GND) R1.1 S3.1 TP54.TESTPOINT U1.4(GND) U1.17(GND) U1.20(GND) U1.24(GND) U1.26(TEST) U16.6(GND) U16.17(GNDANA) U16.30(GND) U16.48(GND) U16.THERMAL(GND) X1.2(GND) X1.4(GND) ; also sheet 1,2,3,4,5,6,7,8,9,10,11,12,13,15
MOD2_USB+: U16.47(PA26) ; also sheet 12
MOD2_USB-: U16.46(PA25) ; also sheet 12
MOD_SCL: U16.44(PA24) ; also sheet 1,8,15
MOD_SDA: U16.43(PA23) ; also sheet 1,8,15
N$38: C41.1 FB6.1 U16.19(VDDANA)
N$39: L1.P$2 U16.5(VDDCORE)
N$40: U16.28(BIASH) U16.29(BIASL)
N$41: U16.25(CAPH) U16.26(CAPL)
N$42: J4.2(D-) U1.15(USBDM)
N$44: C45.1 C67.1 L1.P$1 U16.7(VDDOUT)
N$45: J4.3(D+) U1.14(USBDP)
N$46: C46.1 FB1.2 J4.1(+5V)
N$48: C47.1 FB1.1 U1.19(VCC)
N$49: C48.1 U1.1(VCCIO) U1.16(3V3OUT)
PPS: U16.37(PA18) ; also sheet 1,9,15
RADIO_!RESET: S3.2 U16.4(!RESET) ; also sheet 4
RADIO_RX: U1.30(TXD) U16.23(PA11)
RADIO_SWDCLK: R88.1 U16.9(TCK) ; also sheet 4
RADIO_SWDIO: R87.1 U16.10(PA03) ; also sheet 4
RADIO_TX: U1.2(RXD) U16.24(PA12)
Unconnected: J4.4(ID) U1.3(!RI) U1.6(!DSR) U1.7(!DCD) U1.8(!CTS) U1.9(CBUS4) U1.10(CBUS2) U1.11(CBUS3) U1.18(!RESET) U1.21(CBUS1) U1.22(CBUS0) U1.27(OSCI) U1.28(OSCO) U1.31(!DTR) U1.32(!RTS) U16.11(PA04) U16.12(PA05) U16.13(XIN32) U16.14(XOUT32) U16.15(PA06) U16.16(PA07) U16.18(ADVREFP) U16.20(PA08) U16.21(PA09) U16.22(PA10) U16.32(PA13) U16.33(PA14) U16.34(PA15) U16.35(PA16) U16.36(PA17) U16.41(PA21) U16.42(PA22)

### Notes on the sheet
- The "Radio Module"
- Controller

## Sheet 15 of 15
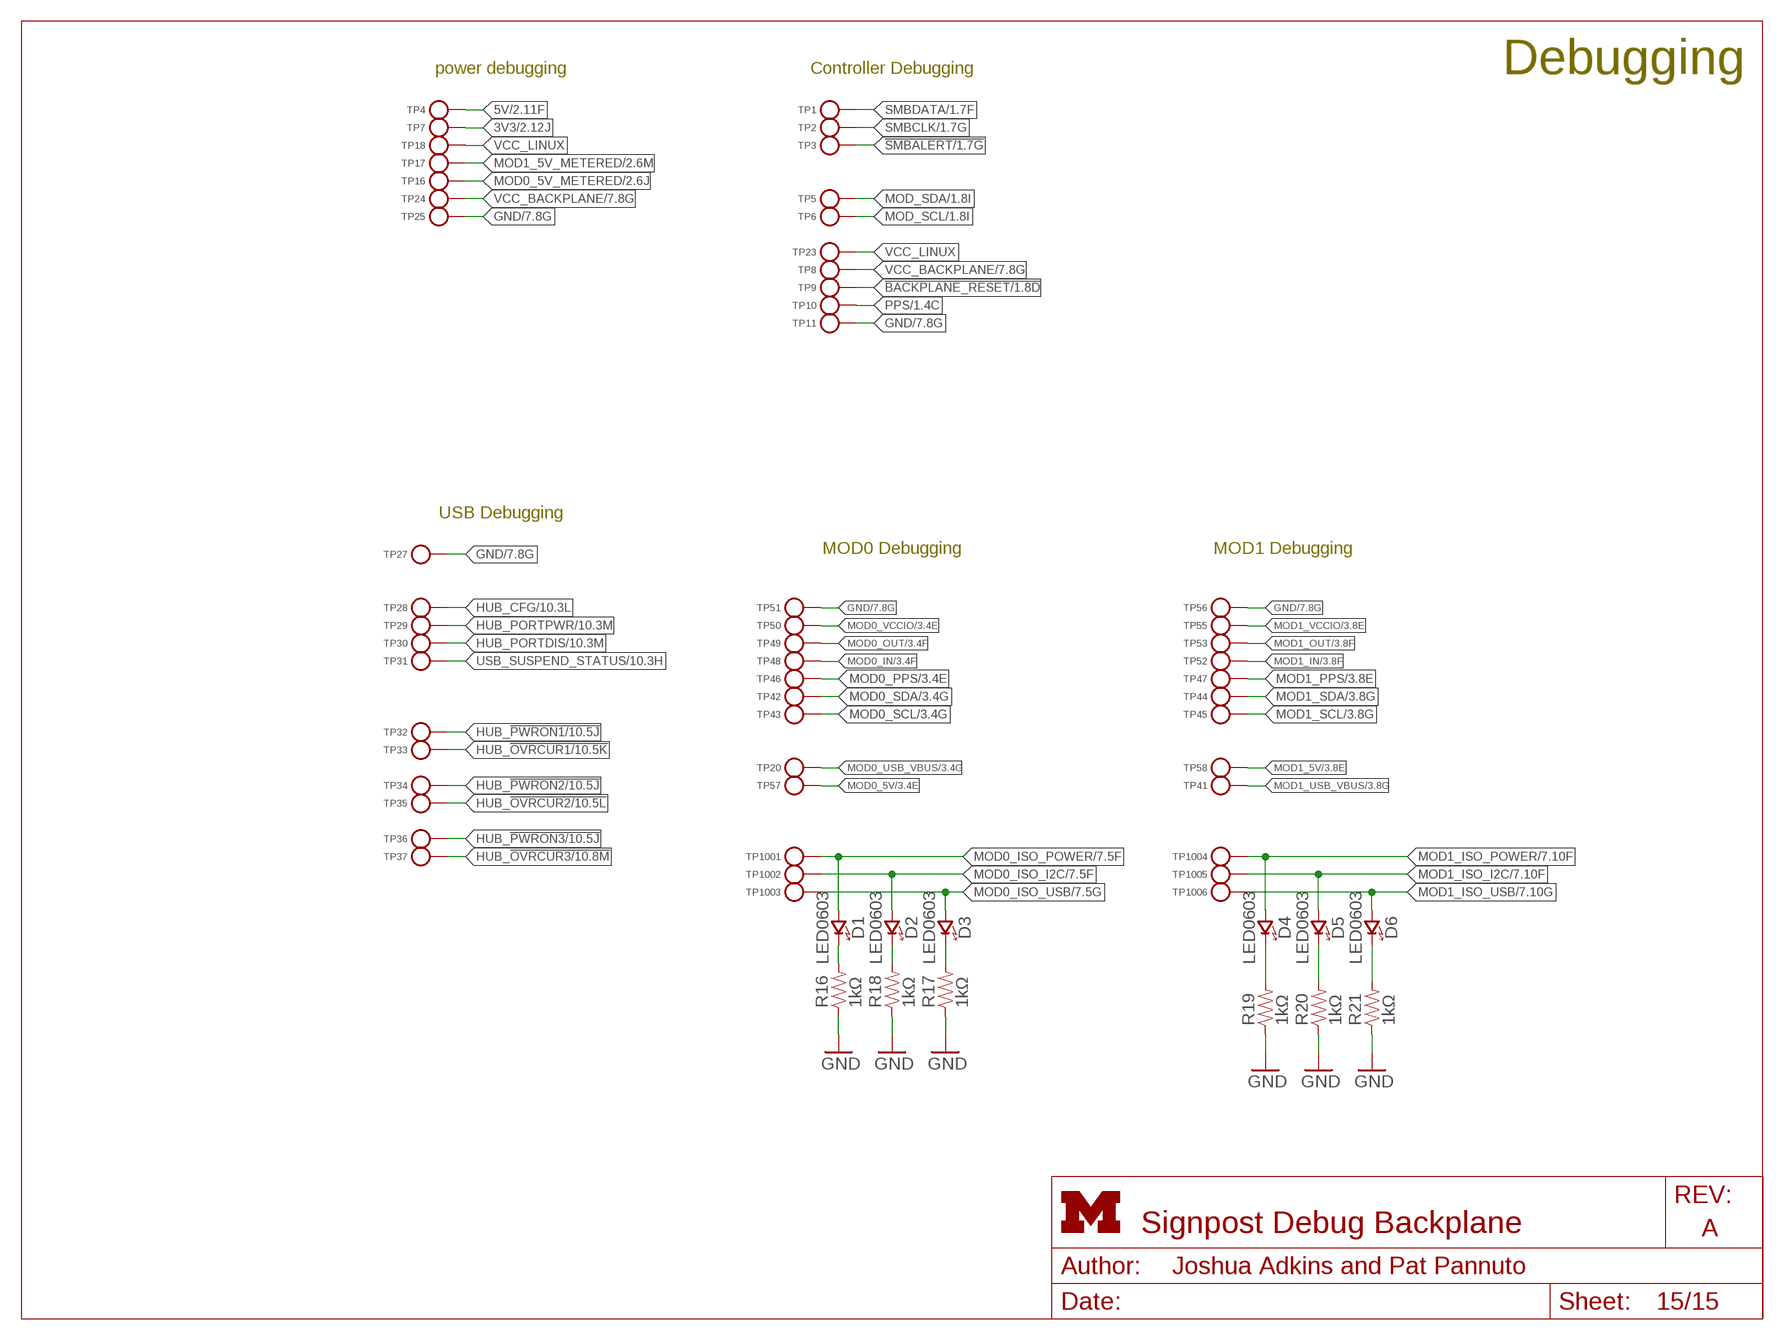
[diagram p14: schematic, sheet 15]
FRAME9 (LETTER_L_UMICH): HEIGHT: 8.5in; WIDTH: 11in

### Parts
D1  LED0603  [LED-0603]
D2  LED0603  [LED-0603]
D3  LED0603  [LED-0603]
D4  LED0603  [LED-0603]
D5  LED0603  [LED-0603]
D6  LED0603  [LED-0603]
R16  1kΩ  RESISTOR0603_RES  [0603-RES]
R17  1kΩ  RESISTOR0603_RES  [0603-RES]
R18  1kΩ  RESISTOR0603_RES  [0603-RES]
R19  1kΩ  RESISTOR0603_RES  [0603-RES]
R20  1kΩ  RESISTOR0603_RES  [0603-RES]
R21  1kΩ  RESISTOR0603_RES  [0603-RES]
TP1  TEST_POINT_0.040IN  [TESTPOINT_0.040IN]
TP2  TEST_POINT_0.040IN  [TESTPOINT_0.040IN]
TP3  TEST_POINT_0.040IN  [TESTPOINT_0.040IN]
TP4  TEST_POINT_0.040IN  [TESTPOINT_0.040IN]
TP5  TEST_POINT_0.040IN  [TESTPOINT_0.040IN]
TP6  TEST_POINT_0.040IN  [TESTPOINT_0.040IN]
TP7  TEST_POINT_0.040IN  [TESTPOINT_0.040IN]
TP8  TEST_POINT_0.040IN  [TESTPOINT_0.040IN]
TP9  TEST_POINT_0.040IN  [TESTPOINT_0.040IN]
TP10  TEST_POINT_0.040IN  [TESTPOINT_0.040IN]
TP11  TEST_POINT_0.040IN  [TESTPOINT_0.040IN]
TP16  TEST_POINT_0.040IN  [TESTPOINT_0.040IN]
TP17  TEST_POINT_0.040IN  [TESTPOINT_0.040IN]
TP18  TEST_POINT_0.040IN  [TESTPOINT_0.040IN]
TP20  TEST_POINT_0.040IN  [TESTPOINT_0.040IN]
TP23  TEST_POINT_0.040IN  [TESTPOINT_0.040IN]
TP24  TEST_POINT_0.040IN  [TESTPOINT_0.040IN]
TP25  TEST_POINT_0.040IN  [TESTPOINT_0.040IN]
TP27  TEST_POINT_0.040IN  [TESTPOINT_0.040IN]
TP28  TEST_POINT_0.040IN  [TESTPOINT_0.040IN]
TP29  TEST_POINT_0.040IN  [TESTPOINT_0.040IN]
TP30  TEST_POINT_0.040IN  [TESTPOINT_0.040IN]
TP31  TEST_POINT_0.040IN  [TESTPOINT_0.040IN]
TP32  TEST_POINT_0.040IN  [TESTPOINT_0.040IN]
TP33  TEST_POINT_0.040IN  [TESTPOINT_0.040IN]
TP34  TEST_POINT_0.040IN  [TESTPOINT_0.040IN]
TP35  TEST_POINT_0.040IN  [TESTPOINT_0.040IN]
TP36  TEST_POINT_0.040IN  [TESTPOINT_0.040IN]
TP37  TEST_POINT_0.040IN  [TESTPOINT_0.040IN]
TP41  TEST_POINT_0.040IN  [TESTPOINT_0.040IN]
TP42  TEST_POINT_0.040IN  [TESTPOINT_0.040IN]
TP43  TEST_POINT_0.040IN  [TESTPOINT_0.040IN]
TP44  TEST_POINT_0.040IN  [TESTPOINT_0.040IN]
TP45  TEST_POINT_0.040IN  [TESTPOINT_0.040IN]
TP46  TEST_POINT_0.040IN  [TESTPOINT_0.040IN]
TP47  TEST_POINT_0.040IN  [TESTPOINT_0.040IN]
TP48  TEST_POINT_0.040IN  [TESTPOINT_0.040IN]
TP49  TEST_POINT_0.040IN  [TESTPOINT_0.040IN]
TP50  TEST_POINT_0.040IN  [TESTPOINT_0.040IN]
TP51  TEST_POINT_0.040IN  [TESTPOINT_0.040IN]
TP52  TEST_POINT_0.040IN  [TESTPOINT_0.040IN]
TP53  TEST_POINT_0.040IN  [TESTPOINT_0.040IN]
TP55  TEST_POINT_0.040IN  [TESTPOINT_0.040IN]
TP56  TEST_POINT_0.040IN  [TESTPOINT_0.040IN]
TP57  TEST_POINT_0.040IN  [TESTPOINT_0.040IN]
TP58  TEST_POINT_0.040IN  [TESTPOINT_0.040IN]
TP1001  TEST_POINT_0.040IN  [TESTPOINT_0.040IN]
TP1002  TEST_POINT_0.040IN  [TESTPOINT_0.040IN]
TP1003  TEST_POINT_0.040IN  [TESTPOINT_0.040IN]
TP1004  TEST_POINT_0.040IN  [TESTPOINT_0.040IN]
TP1005  TEST_POINT_0.040IN  [TESTPOINT_0.040IN]
TP1006  TEST_POINT_0.040IN  [TESTPOINT_0.040IN]

### Nets
3V3: TP7.TESTPOINT ; also sheet 2,4,5,6,14
5V: TP4.TESTPOINT ; also sheet 2
!BACKPLANE_RESET: TP9.TESTPOINT ; also sheet 1,7,10
!SMBALERT: TP3.TESTPOINT ; also sheet 1,2
GND: R16.1 R17.1 R18.1 R19.1 R20.1 R21.1 TP11.TESTPOINT TP25.TESTPOINT TP27.TESTPOINT TP51.TESTPOINT TP56.TESTPOINT ; also sheet 1,2,3,4,5,6,7,8,9,10,11,12,13,14
HUB_!OVRCUR1: TP33.TESTPOINT ; also sheet 10,13
HUB_!OVRCUR2: TP35.TESTPOINT ; also sheet 10,13
HUB_!OVRCUR3: TP37.TESTPOINT ; also sheet 10
HUB_!PWRON1: TP32.TESTPOINT ; also sheet 10,13
HUB_!PWRON2: TP34.TESTPOINT ; also sheet 10,13
HUB_!PWRON3: TP36.TESTPOINT ; also sheet 10
HUB_CFG: TP28.TESTPOINT ; also sheet 10
HUB_PORTDIS: TP30.TESTPOINT ; also sheet 10
HUB_PORTPWR: TP29.TESTPOINT ; also sheet 10
MOD0_5V: TP57.TESTPOINT ; also sheet 3,8
MOD0_5V_METERED: TP16.TESTPOINT ; also sheet 2,8,13
MOD0_IN: TP48.TESTPOINT ; also sheet 3,9
MOD0_ISO_I2C: D2.A(ANODE) TP1002.TESTPOINT ; also sheet 7,8
MOD0_ISO_POWER: D1.A(ANODE) TP1001.TESTPOINT ; also sheet 7,8
MOD0_ISO_USB: D3.A(ANODE) TP1003.TESTPOINT ; also sheet 7,13
MOD0_OUT: TP49.TESTPOINT ; also sheet 3,9
MOD0_PPS: TP46.TESTPOINT ; also sheet 3,9
MOD0_SCL: TP43.TESTPOINT ; also sheet 3,8
MOD0_SDA: TP42.TESTPOINT ; also sheet 3,8
MOD0_USB_VBUS: TP20.TESTPOINT ; also sheet 3,13
MOD0_VCCIO: TP50.TESTPOINT ; also sheet 3,4,5,8,9
MOD1_5V: TP58.TESTPOINT ; also sheet 3,8
MOD1_5V_METERED: TP17.TESTPOINT ; also sheet 2,8,13
MOD1_IN: TP52.TESTPOINT ; also sheet 3,9
MOD1_ISO_I2C: D5.A(ANODE) TP1005.TESTPOINT ; also sheet 7,8
MOD1_ISO_POWER: D4.A(ANODE) TP1004.TESTPOINT ; also sheet 7,8
MOD1_ISO_USB: D6.A(ANODE) TP1006.TESTPOINT ; also sheet 7,13
MOD1_OUT: TP53.TESTPOINT ; also sheet 3,9
MOD1_PPS: TP47.TESTPOINT ; also sheet 3,9
MOD1_SCL: TP45.TESTPOINT ; also sheet 3,8
MOD1_SDA: TP44.TESTPOINT ; also sheet 3,8
MOD1_USB_VBUS: TP41.TESTPOINT ; also sheet 3,13
MOD1_VCCIO: TP55.TESTPOINT ; also sheet 3,4,5,8,9
MOD_SCL: TP6.TESTPOINT ; also sheet 1,8,14
MOD_SDA: TP5.TESTPOINT ; also sheet 1,8,14
N$1: D1.C(CATHODE) R16.2
N$2: D2.C(CATHODE) R18.2
N$3: D3.C(CATHODE) R17.2
N$10: D4.C(CATHODE) R19.2
N$11: D5.C(CATHODE) R20.2
N$13: D6.C(CATHODE) R21.2
PPS: TP10.TESTPOINT ; also sheet 1,9,14
SMBCLK: TP2.TESTPOINT ; also sheet 1,2,7
SMBDATA: TP1.TESTPOINT ; also sheet 1,2,7
USB_SUSPEND_STATUS: TP31.TESTPOINT ; also sheet 10
VCC_BACKPLANE: TP8.TESTPOINT TP24.TESTPOINT ; also sheet 1,2,7,8,9,10,11,12,13
VCC_LINUX: TP18.TESTPOINT TP23.TESTPOINT ; also sheet 1,2

### Notes on the sheet
- Debugging
- power debugging | Controller Debugging
- USB Debugging
- MOD0 Debugging | MOD1 Debugging

## Library data of the parts
C1 C2 = passives:CAPACITOR: 0402 Capacitor; DIGIKEY: 490-8230-1-ND
C3 C4 = passives:CAPACITOR: 0402 Capacitor; DIGIKEY: 1276-1023-1-ND
C5-C40 C49-C66 = passives:CAPACITOR: 0402 Capacitor
C41-C48 = passives:CAPACITOR: 0402 Capacitor; DIGIKEY: 490-10777-1-ND
C67 = passives:CAPACITOR: 0402 Capacitor; DIGIKEY: 490-13252-1-ND
C68 C69 = passives:CAPACITOR: 0402 Capacitor; DIGIKEY: 1276-3367-1-ND
D1-D6 LED1-LED13 = leds:LED: LED
D7 D8 = signpost:SN75240-TSSOP: TVS Diodes [suggested for TI USB Hub] (2 array); DIGIKEY: 296-6596-1-ND
FB1-FB5 = passives:FERRITE_BEAD
FB6 = passives:FERRITE_BEAD; DIGIKEY: 490-5216-1-ND
J1 = signpost:BACKPLANE_CONTROLLER_MODULE_DEBUG: Control module for signpost, with debug headers; DIGIKEY: S9197-ND , S9194-ND , S7072-ND , S7072-ND
J2 J3 = signpost:BACKPLANE_GENERIC_MODULE_DEBUG: A backplane header for the debug module; DIGIKEY: S9195-ND , S7072-ND
J4-J9 = connector:MICRO_USB_B_HIROSE_ZX62R-B-5P: USB Micro B Connector Rounded side is up.; DIGIKEY: H11574CT-ND; MOUSER: 798-ZX62R-B-5P; NEWARK: 69W0714
J10 = con-ml:ML20: HARTING; OC_FARNELL: unknown; OC_NEWARK: unknown
J11 = connector:PJ-102AH: DC Power Jack 2.0mm / 5.5mm; DIGIKEY: CP-102AH-ND
L1 = signpost:LHQ3NP: LHQ3NP Inductor; DIGIKEY: 490-5350-1-ND
Q1 = fets:DMN32D2LDF: Common source dual n-channel mosfet; DIGIKEY: DMN32D2LDF-7DICT-ND
Q2-Q9 = fets:MOSFET-NCHANNEL: Generic NMOS footprint
R1 R71 = passives:RESISTOR: Resistor Basic schematic elements and footprints for 0603, 1206, and PTH resistors.; DIGIKEY: 1276-3431-1-ND
R2-R5 R12-R70 R72-R86 R89-R96 = passives:RESISTOR: Resistor Basic schematic elements and footprints for 0603, 1206, and PTH resistors.
R6-R11 = passives:RESISTOR-HIGH_SPEED: Resistor with keepout, for inline on high-speed traces (e.g. USB)
R87 R88 = passives:RESISTOR: Resistor Basic schematic elements and footprints for 0603, 1206, and PTH resistors.; DIGIKEY: 1276-3432-1-ND
S1 S2 = signpost:AP2401MP: USB Power Switch; DIGIKEY: AP2401MP-13DICT-ND
S3-S8 = switches:B3U: Switch; DIGIKEY: SW1020CT-ND
S9 S10 = signpost:NC7SZ157: MUX; DIGIKEY: NC7SZ157P6XCT-ND
S11 = switches:RM106772BCB: Rotary Switch 6 Position SP6T 500mA (DC) 24VDC Through Hole; DIGIKEY: CKN10703-ND
S12 S13 = signpost:SIP3240X: High power (2.4 A) high-side switch; DIGIKEY: SIP32402ADNP-T1GE4CT-ND
S14-S18 = switches:SN74AHC4066; DIGIKEY: 296-15258-1-ND
S19 = switches:TE_SSA12/SPDT: SWITCH SLIDE SPDT 2POS SSA SER; DIGIKEY: 450-1602-ND
TP1-TP18 TP20 TP21 TP23-TP25 TP27-TP58 TP1001-TP1006 = headers:TEST_POINT_0.040IN: 0.040in Test Point; DIGIKEY: 5001K-ND
U1-U5 = ftdichip:FT232R: Source: http://www.ftdichip.com/Documents/DataSheets/DS_FT232R_v104.pdf; MPN: FT232RQ; OC_FARNELL: 1146033; OC_NEWARK: 91K9919
U6 U7 = signpost:FXMA2102: Dual Supply, 2-Bit Voltage Translator / Buffer / Repeater / Isolator for I2C; DIGIKEY: FXMA2102UMXCT-ND
U8-U11 = signpost:LTC2941: I2C Battery Gas Gauge with External Sense Resistor; DIGIKEY: LTC2941IDCB#TRMPBFCT-ND
U12 = chips:MAX8887: IC REG LDO 3.3V 0.3A TSOT23-5; DIGIKEY: MAX8887EZK33+TCT-ND
U13 U14 = signpost:MCP23008: GPIO Extender via I2C - 8 Pin; DIGIKEY: MCP23008-E/ML-ND
U15 = signpost:PCA9544A: 1-4 I2C/SMBUS Multiplexer with interrupt for power supply coulomb counters; DIGIKEY: 296-20960-1-ND
U16 = chips:SAM4LC8AA: Atmel SAM4L microcontroller. ARM Cortex M4 with 512 KB Flash and 64 KB RAM; DIGIKEY: ATSAM4LC8AA-MU-ND
U17-U20 = signpost:SN74LVC2T45: Bidirectional Buffer / Level Converter 2 Circuits; DIGIKEY: 296-17014-1-ND
U21-U23 = signpost:TS3USB30E: USB Mux with OE control and ESD; DIGIKEY: 296-24684-1-ND
U24 = signpost:TUSB2077A: Full Speed USB Hub - 7 Port; DIGIKEY: 296-37871-1-ND
X1 = crystals:FH1600015: Pericom Type FH 16 MHz 2.5 x 2.0 mm; DIGIKEY: FH1600015CT-ND
Y1 = crystals:ABMM: Low-Profile SMD crystal; DIGIKEY: 535-10156-1-ND